# EAGLE design front-panel-board (EAGLE 5.11)
DRAWN_BY: Alexios; PROJECT_NAME: CFT Mini-Computer; REVISION: Rev D; SHEET_DESCRIPTION: Front Panel: Switch board; SIMULATION_FILENAME: N/A; URL: http://www.bedroomlan.org/cft

## Sheet 1 of 2
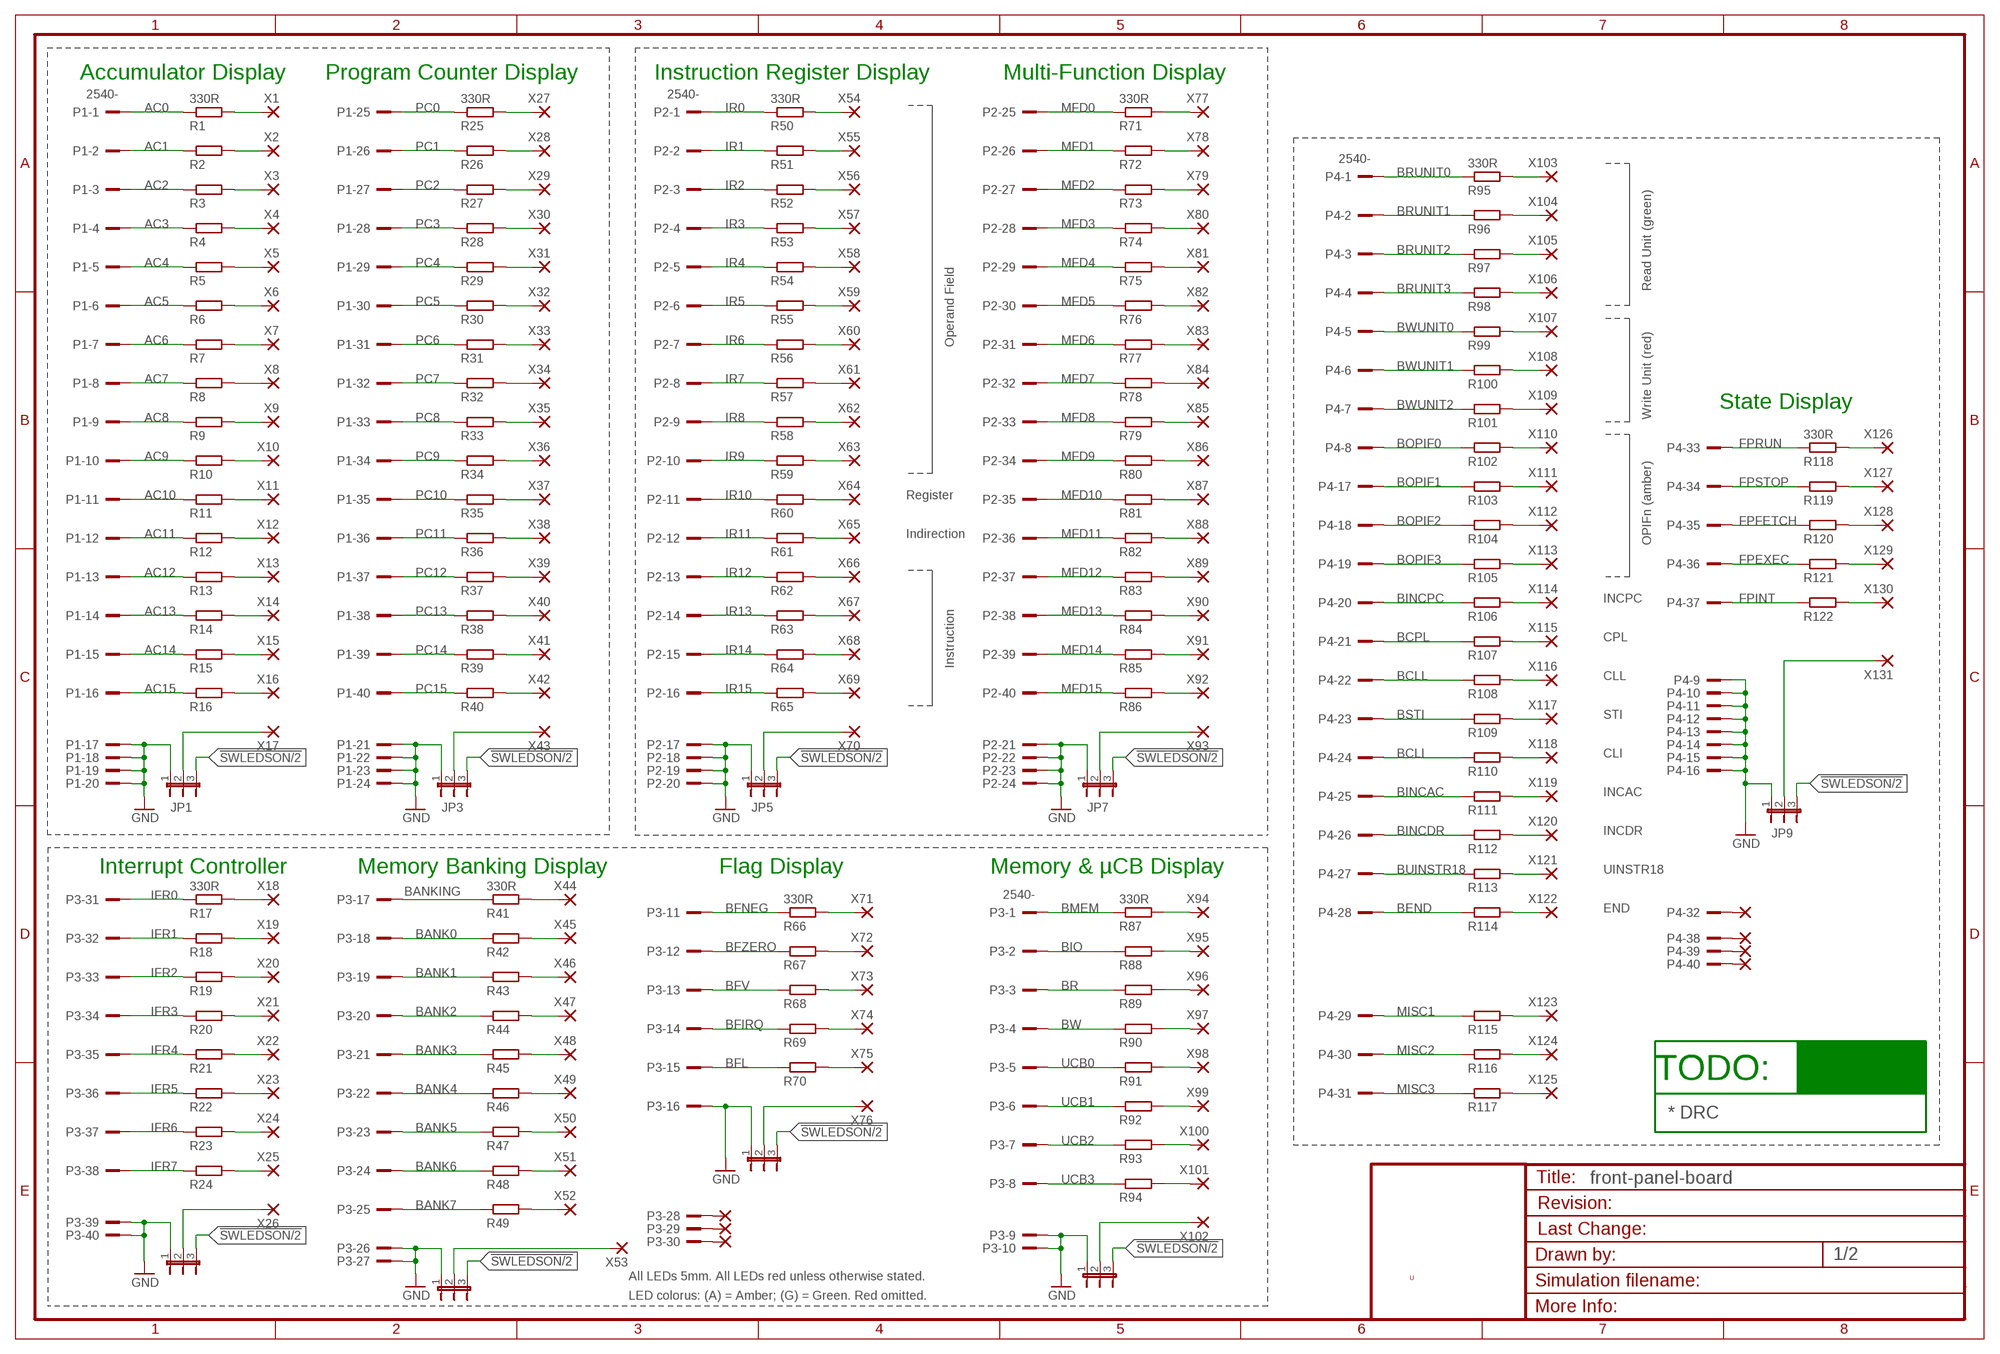
[diagram p0: schematic, sheet 1]

### Parts
JP1  JP2E  [JP2]
JP2  JP2E  [JP2]
JP3  JP2E  [JP2]
JP4  JP2E  [JP2]
JP5  JP2E  [JP2]
JP6  JP2E  [JP2]
JP7  JP2E  [JP2]
JP8  JP2E  [JP2]
JP9  JP2E  [JP2]
P1  2540-  [PAK100/2500-40]
P2  2540-  [PAK100/2500-40]
P3  2540-  [PAK100/2500-40]
P4  2540-  [PAK100/2500-40]
PAD1  1,6/0,8  [1,6/0,8]
PAD2  1,6/0,8  [1,6/0,8]
PAD3  1,6/0,8  [1,6/0,8]
PAD4  1,6/0,8  [1,6/0,8]
PAD5  1,6/0,8  [1,6/0,8]
PAD6  1,6/0,8  [1,6/0,8]
PAD7  1,6/0,8  [1,6/0,8]
R1  330R  R-EU_0204/7  [0204/7]
R2  330R  R-EU_0204/7  [0204/7]
R3  330R  R-EU_0204/7  [0204/7]
R4  330R  R-EU_0204/7  [0204/7]
R5  330R  R-EU_0204/7  [0204/7]
R6  330R  R-EU_0204/7  [0204/7]
R7  330R  R-EU_0204/7  [0204/7]
R8  330R  R-EU_0204/7  [0204/7]
R9  330R  R-EU_0204/7  [0204/7]
R10  330R  R-EU_0204/7  [0204/7]
R11  330R  R-EU_0204/7  [0204/7]
R12  330R  R-EU_0204/7  [0204/7]
R13  330R  R-EU_0204/7  [0204/7]
R14  330R  R-EU_0204/7  [0204/7]
R15  330R  R-EU_0204/7  [0204/7]
R16  330R  R-EU_0204/7  [0204/7]
R17  330R  R-EU_0204/7  [0204/7]
R18  330R  R-EU_0204/7  [0204/7]
R19  330R  R-EU_0204/7  [0204/7]
R20  330R  R-EU_0204/7  [0204/7]
R21  330R  R-EU_0204/7  [0204/7]
R22  330R  R-EU_0204/7  [0204/7]
R23  330R  R-EU_0204/7  [0204/7]
R24  330R  R-EU_0204/7  [0204/7]
R25  330R  R-EU_0204/7  [0204/7]
R26  330R  R-EU_0204/7  [0204/7]
R27  330R  R-EU_0204/7  [0204/7]
R28  330R  R-EU_0204/7  [0204/7]
R29  330R  R-EU_0204/7  [0204/7]
R30  330R  R-EU_0204/7  [0204/7]
R31  330R  R-EU_0204/7  [0204/7]
R32  330R  R-EU_0204/7  [0204/7]
R33  330R  R-EU_0204/7  [0204/7]
R34  330R  R-EU_0204/7  [0204/7]
R35  330R  R-EU_0204/7  [0204/7]
R36  330R  R-EU_0204/7  [0204/7]
R37  330R  R-EU_0204/7  [0204/7]
R38  330R  R-EU_0204/7  [0204/7]
R39  330R  R-EU_0204/7  [0204/7]
R40  330R  R-EU_0204/7  [0204/7]
R41  330R  R-EU_0204/7  [0204/7]
R42  330R  R-EU_0204/7  [0204/7]
R43  330R  R-EU_0204/7  [0204/7]
R44  330R  R-EU_0204/7  [0204/7]
R45  330R  R-EU_0204/7  [0204/7]
R46  330R  R-EU_0204/7  [0204/7]
R47  330R  R-EU_0204/7  [0204/7]
R48  330R  R-EU_0204/7  [0204/7]
R49  330R  R-EU_0204/7  [0204/7]
R50  330R  R-EU_0204/7  [0204/7]
R51  330R  R-EU_0204/7  [0204/7]
R52  330R  R-EU_0204/7  [0204/7]
R53  330R  R-EU_0204/7  [0204/7]
R54  330R  R-EU_0204/7  [0204/7]
R55  330R  R-EU_0204/7  [0204/7]
R56  330R  R-EU_0204/7  [0204/7]
R57  330R  R-EU_0204/7  [0204/7]
R58  330R  R-EU_0204/7  [0204/7]
R59  330R  R-EU_0204/7  [0204/7]
R60  330R  R-EU_0204/7  [0204/7]
R61  330R  R-EU_0204/7  [0204/7]
R62  330R  R-EU_0204/7  [0204/7]
R63  330R  R-EU_0204/7  [0204/7]
R64  330R  R-EU_0204/7  [0204/7]
R65  330R  R-EU_0204/7  [0204/7]
R66  330R  R-EU_0204/7  [0204/7]
R67  330R  R-EU_0204/7  [0204/7]
R68  330R  R-EU_0204/7  [0204/7]
R69  330R  R-EU_0204/7  [0204/7]
R70  330R  R-EU_0204/7  [0204/7]
R71  330R  R-EU_0204/7  [0204/7]
R72  330R  R-EU_0204/7  [0204/7]
R73  330R  R-EU_0204/7  [0204/7]
R74  330R  R-EU_0204/7  [0204/7]
R75  330R  R-EU_0204/7  [0204/7]
R76  330R  R-EU_0204/7  [0204/7]
R77  330R  R-EU_0204/7  [0204/7]
R78  330R  R-EU_0204/7  [0204/7]
R79  330R  R-EU_0204/7  [0204/7]
R80  330R  R-EU_0204/7  [0204/7]
R81  330R  R-EU_0204/7  [0204/7]
R82  330R  R-EU_0204/7  [0204/7]
R83  330R  R-EU_0204/7  [0204/7]
R84  330R  R-EU_0204/7  [0204/7]
R85  330R  R-EU_0204/7  [0204/7]
R86  330R  R-EU_0204/7  [0204/7]
R87  330R  R-EU_0204/7  [0204/7]
R88  330R  R-EU_0204/7  [0204/7]
R89  330R  R-EU_0204/7  [0204/7]
R90  330R  R-EU_0204/7  [0204/7]
R91  330R  R-EU_0204/7  [0204/7]
R92  330R  R-EU_0204/7  [0204/7]
R93  330R  R-EU_0204/7  [0204/7]
R94  330R  R-EU_0204/7  [0204/7]
R95  330R  R-EU_0204/7  [0204/7]
R96  330R  R-EU_0204/7  [0204/7]
R97  330R  R-EU_0204/7  [0204/7]
R98  330R  R-EU_0204/7  [0204/7]
R99  330R  R-EU_0204/7  [0204/7]
R100  330R  R-EU_0204/7  [0204/7]
R101  330R  R-EU_0204/7  [0204/7]
R102  330R  R-EU_0204/7  [0204/7]
R103  330R  R-EU_0204/7  [0204/7]
R104  330R  R-EU_0204/7  [0204/7]
R105  330R  R-EU_0204/7  [0204/7]
R106  330R  R-EU_0204/7  [0204/7]
R107  330R  R-EU_0204/7  [0204/7]
R108  330R  R-EU_0204/7  [0204/7]
R109  330R  R-EU_0204/7  [0204/7]
R110  330R  R-EU_0204/7  [0204/7]
R111  330R  R-EU_0204/7  [0204/7]
R112  330R  R-EU_0204/7  [0204/7]
R113  330R  R-EU_0204/7  [0204/7]
R114  330R  R-EU_0204/7  [0204/7]
R115  330R  R-EU_0204/7  [0204/7]
R116  330R  R-EU_0204/7  [0204/7]
R117  330R  R-EU_0204/7  [0204/7]
R118  330R  R-EU_0204/7  [0204/7]
R119  330R  R-EU_0204/7  [0204/7]
R120  330R  R-EU_0204/7  [0204/7]
R121  330R  R-EU_0204/7  [0204/7]
R122  330R  R-EU_0204/7  [0204/7]
X1  1,6/0,9  [1,6/0,9]
X2  1,6/0,9  [1,6/0,9]
X3  1,6/0,9  [1,6/0,9]
X4  1,6/0,9  [1,6/0,9]
X5  1,6/0,9  [1,6/0,9]
X6  1,6/0,9  [1,6/0,9]
X7  1,6/0,9  [1,6/0,9]
X8  1,6/0,9  [1,6/0,9]
X9  1,6/0,9  [1,6/0,9]
X10  1,6/0,9  [1,6/0,9]
X11  1,6/0,9  [1,6/0,9]
X12  1,6/0,9  [1,6/0,9]
X13  1,6/0,9  [1,6/0,9]
X14  1,6/0,9  [1,6/0,9]
X15  1,6/0,9  [1,6/0,9]
X16  1,6/0,9  [1,6/0,9]
X17  2,54/1,0  [2,54/1,0]
X18  1,6/0,9  [1,6/0,9]
X19  1,6/0,9  [1,6/0,9]
X20  1,6/0,9  [1,6/0,9]
X21  1,6/0,9  [1,6/0,9]
X22  1,6/0,9  [1,6/0,9]
X23  1,6/0,9  [1,6/0,9]
X24  1,6/0,9  [1,6/0,9]
X25  1,6/0,9  [1,6/0,9]
X26  2,54/1,0  [2,54/1,0]
X27  1,6/0,9  [1,6/0,9]
X28  1,6/0,9  [1,6/0,9]
X29  1,6/0,9  [1,6/0,9]
X30  1,6/0,9  [1,6/0,9]
X31  1,6/0,9  [1,6/0,9]
X32  1,6/0,9  [1,6/0,9]
X33  1,6/0,9  [1,6/0,9]
X34  1,6/0,9  [1,6/0,9]
X35  1,6/0,9  [1,6/0,9]
X36  1,6/0,9  [1,6/0,9]
X37  1,6/0,9  [1,6/0,9]
X38  1,6/0,9  [1,6/0,9]
X39  1,6/0,9  [1,6/0,9]
X40  1,6/0,9  [1,6/0,9]
X41  1,6/0,9  [1,6/0,9]
X42  1,6/0,9  [1,6/0,9]
X43  2,54/1,0  [2,54/1,0]
X44  1,6/0,9  [1,6/0,9]
X45  1,6/0,9  [1,6/0,9]
X46  1,6/0,9  [1,6/0,9]
X47  1,6/0,9  [1,6/0,9]
X48  1,6/0,9  [1,6/0,9]
X49  1,6/0,9  [1,6/0,9]
X50  1,6/0,9  [1,6/0,9]
X51  1,6/0,9  [1,6/0,9]
X52  1,6/0,9  [1,6/0,9]
X53  2,54/1,0  [2,54/1,0]
X54  1,6/0,9  [1,6/0,9]
X55  1,6/0,9  [1,6/0,9]
X56  1,6/0,9  [1,6/0,9]
X57  1,6/0,9  [1,6/0,9]
X58  1,6/0,9  [1,6/0,9]
X59  1,6/0,9  [1,6/0,9]
X60  1,6/0,9  [1,6/0,9]
X61  1,6/0,9  [1,6/0,9]
X62  1,6/0,9  [1,6/0,9]
X63  1,6/0,9  [1,6/0,9]
X64  1,6/0,9  [1,6/0,9]
X65  1,6/0,9  [1,6/0,9]
X66  1,6/0,9  [1,6/0,9]
X67  1,6/0,9  [1,6/0,9]
X68  1,6/0,9  [1,6/0,9]
X69  1,6/0,9  [1,6/0,9]
X70  2,54/1,0  [2,54/1,0]
X71  1,6/0,9  [1,6/0,9]
X72  1,6/0,9  [1,6/0,9]
X73  1,6/0,9  [1,6/0,9]
X74  1,6/0,9  [1,6/0,9]
X75  1,6/0,9  [1,6/0,9]
X76  2,54/1,0  [2,54/1,0]
X77  1,6/0,9  [1,6/0,9]
X78  1,6/0,9  [1,6/0,9]
X79  1,6/0,9  [1,6/0,9]
X80  1,6/0,9  [1,6/0,9]
X81  1,6/0,9  [1,6/0,9]
X82  1,6/0,9  [1,6/0,9]
X83  1,6/0,9  [1,6/0,9]
X84  1,6/0,9  [1,6/0,9]
X85  1,6/0,9  [1,6/0,9]
X86  1,6/0,9  [1,6/0,9]
X87  1,6/0,9  [1,6/0,9]
X88  1,6/0,9  [1,6/0,9]
X89  1,6/0,9  [1,6/0,9]
X90  1,6/0,9  [1,6/0,9]
X91  1,6/0,9  [1,6/0,9]
X92  1,6/0,9  [1,6/0,9]
X93  2,54/1,0  [2,54/1,0]
X94  1,6/0,9  [1,6/0,9]
X95  1,6/0,9  [1,6/0,9]
X96  1,6/0,9  [1,6/0,9]
X97  1,6/0,9  [1,6/0,9]
X98  1,6/0,9  [1,6/0,9]
X99  1,6/0,9  [1,6/0,9]
X100  1,6/0,9  [1,6/0,9]
X101  1,6/0,9  [1,6/0,9]
X102  2,54/1,0  [2,54/1,0]
X103  1,6/0,9  [1,6/0,9]
X104  1,6/0,9  [1,6/0,9]
X105  1,6/0,9  [1,6/0,9]
X106  1,6/0,9  [1,6/0,9]
X107  1,6/0,9  [1,6/0,9]
X108  1,6/0,9  [1,6/0,9]
X109  1,6/0,9  [1,6/0,9]
X110  1,6/0,9  [1,6/0,9]
X111  1,6/0,9  [1,6/0,9]
X112  1,6/0,9  [1,6/0,9]
X113  1,6/0,9  [1,6/0,9]
X114  1,6/0,9  [1,6/0,9]
X115  1,6/0,9  [1,6/0,9]
X116  1,6/0,9  [1,6/0,9]
X117  1,6/0,9  [1,6/0,9]
X118  1,6/0,9  [1,6/0,9]
X119  1,6/0,9  [1,6/0,9]
X120  1,6/0,9  [1,6/0,9]
X121  1,6/0,9  [1,6/0,9]
X122  1,6/0,9  [1,6/0,9]
X123  1,6/0,9  [1,6/0,9]
X124  1,6/0,9  [1,6/0,9]
X125  1,6/0,9  [1,6/0,9]
X126  1,6/0,9  [1,6/0,9]
X127  1,6/0,9  [1,6/0,9]
X128  1,6/0,9  [1,6/0,9]
X129  1,6/0,9  [1,6/0,9]
X130  1,6/0,9  [1,6/0,9]
X131  2,54/1,0  [2,54/1,0]

### Nets
!SWLEDSON [12V]: JP1.3 JP2.3 JP3.3 JP4.3 JP5.3 JP6.3 JP7.3 JP8.3 JP9.3 ; also sheet 2
AC0: P1.1 R1.1
AC1: P1.2 R2.1
AC2: P1.3 R3.1
AC3: P1.4 R4.1
AC4: P1.5 R5.1
AC5: P1.6 R6.1
AC6: P1.7 R7.1
AC7: P1.8 R8.1
AC8: P1.9 R9.1
AC9: P1.10 R10.1
AC10: P1.11 R11.1
AC11: P1.12 R12.1
AC12: P1.13 R13.1
AC13: P1.14 R14.1
AC14: P1.15 R15.1
AC15: P1.16 R16.1
BANK0: P3.18 R42.1
BANK1: P3.19 R43.1
BANK2: P3.20 R44.1
BANK3: P3.21 R45.1
BANK4: P3.22 R46.1
BANK5: P3.23 R47.1
BANK6: P3.24 R48.1
BANK7: P3.25 R49.1
BANKING: P3.17 R41.1
BCLI: P4.24 R110.1
BCLL: P4.22 R108.1
BCPL: P4.21 R107.1
BEND: P4.28 R114.1
BFIRQ: P3.14 R69.1
BFL: P3.15 R70.1
BFNEG: P3.11 R66.1
BFV: P3.13 R68.1
BFZERO: P3.12 R67.1
BINCAC: P4.25 R111.1
BINCDR: P4.26 R112.1
BINCPC: P4.20 R106.1
BIO: P3.2 R88.1
BMEM: P3.1 R87.1
BOPIF0: P4.8 R102.1
BOPIF1: P4.17 R103.1
BOPIF2: P4.18 R104.1
BOPIF3: P4.19 R105.1
BR: P3.3 R89.1
BRUNIT0: P4.1 R95.1
BRUNIT1: P4.2 R96.1
BRUNIT2: P4.3 R97.1
BRUNIT3: P4.4 R98.1
BSTI: P4.23 R109.1
BUINSTR18: P4.27 R113.1
BW: P3.4 R90.1
BWUNIT0: P4.5 R99.1
BWUNIT1: P4.6 R100.1
BWUNIT2: P4.7 R101.1
FPEXEC: P4.36 R121.1
FPFETCH: P4.35 R120.1
FPINT: P4.37 R122.1
FPRUN: P4.33 R118.1
FPSTOP: P4.34 R119.1
GND [Power]: JP1.1 JP2.1 JP3.1 JP4.1 JP5.1 JP6.1 JP7.1 JP8.1 JP9.1 P1.17 P1.18 P1.19 P1.20 P1.21 P1.22 P1.23 P1.24 P2.17 P2.18 P2.19 P2.20 P2.21 P2.22 P2.23 P2.24 P3.9 P3.10 P3.16 P3.26 P3.27 P3.39 P3.40 P4.9 P4.10 P4.11 P4.12 P4.13 P4.14 P4.15 P4.16 ; also sheet 2
IFR0: P3.31 R17.1
IFR1: P3.32 R18.1
IFR2: P3.33 R19.1
IFR3: P3.34 R20.1
IFR4: P3.35 R21.1
IFR5: P3.36 R22.1
IFR6: P3.37 R23.1
IFR7: P3.38 R24.1
IR0: P2.1 R50.1
IR1: P2.2 R51.1
IR2: P2.3 R52.1
IR3: P2.4 R53.1
IR4: P2.5 R54.1
IR5: P2.6 R55.1
IR6: P2.7 R56.1
IR7: P2.8 R57.1
IR8: P2.9 R58.1
IR9: P2.10 R59.1
IR10: P2.11 R60.1
IR11: P2.12 R61.1
IR12: P2.13 R62.1
IR13: P2.14 R63.1
IR14: P2.15 R64.1
IR15: P2.16 R65.1
MFD0: P2.25 R71.1
MFD1: P2.26 R72.1
MFD2: P2.27 R73.1
MFD3: P2.28 R74.1
MFD4: P2.29 R75.1
MFD5: P2.30 R76.1
MFD6: P2.31 R77.1
MFD7: P2.32 R78.1
MFD8: P2.33 R79.1
MFD9: P2.34 R80.1
MFD10: P2.35 R81.1
MFD11: P2.36 R82.1
MFD12: P2.37 R83.1
MFD13: P2.38 R84.1
MFD14: P2.39 R85.1
MFD15: P2.40 R86.1
MISC1: P4.29 R115.1
MISC2: P4.30 R116.1
MISC3: P4.31 R117.1
N$1 [Power]: JP5.2 X70.1(P)
N$2 [Power]: JP7.2 X93.1(P)
N$3 [Power]: JP2.2 X26.1(P)
N$4 [Power]: JP6.2 X76.1(P)
N$5 [Power]: JP8.2 X102.1(P)
N$6: R24.2 X25.1(P)
N$7: R23.2 X24.1(P)
N$323 [Power]: JP3.2 X43.1(P)
N$324 [Power]: JP1.2 X17.1(P)
N$325: R96.2 X104.1(P)
N$326: R4.2 X4.1(P)
N$327: R67.2 X72.1(P)
N$328: R95.2 X103.1(P)
N$330: R17.2 X18.1(P)
N$412: R3.2 X3.1(P)
N$413: R2.2 X2.1(P)
N$414: R1.2 X1.1(P)
N$415: R7.2 X7.1(P)
N$416: R6.2 X6.1(P)
N$449: R5.2 X5.1(P)
N$450: P3.28 PAD1.1(P)
N$451: R89.2 X96.1(P)
N$470: P4.38 PAD5.1(P)
N$471: P4.39 PAD6.1(P)
N$472: P4.40 PAD7.1(P)
N$473: P4.32 PAD4.1(P)
N$474: P3.29 PAD2.1(P)
N$475: P3.30 PAD3.1(P)
N$477: R10.2 X10.1(P)
N$478: R9.2 X9.1(P)
N$587: R8.2 X8.1(P)
N$588: R13.2 X13.1(P)
N$589: R12.2 X12.1(P)
N$590: R11.2 X11.1(P)
N$591: R16.2 X16.1(P)
N$592: R15.2 X15.1(P)
N$593: R14.2 X14.1(P)
N$594: R28.2 X30.1(P)
N$595: R27.2 X29.1(P)
N$596: R26.2 X28.1(P)
N$597: R25.2 X27.1(P)
N$598: R31.2 X33.1(P)
N$599: R30.2 X32.1(P)
N$600: R29.2 X31.1(P)
N$601: R34.2 X36.1(P)
N$602: R33.2 X35.1(P)
N$603: R32.2 X34.1(P)
N$604: R37.2 X39.1(P)
N$605: R36.2 X38.1(P)
N$606: R35.2 X37.1(P)
N$607: R40.2 X42.1(P)
N$608: R39.2 X41.1(P)
N$609: R38.2 X40.1(P)
N$611: R53.2 X57.1(P)
N$612: R52.2 X56.1(P)
N$613: R51.2 X55.1(P)
N$614: R50.2 X54.1(P)
N$615: R56.2 X60.1(P)
N$616: R55.2 X59.1(P)
N$617: R54.2 X58.1(P)
N$618: R59.2 X63.1(P)
N$619: R58.2 X62.1(P)
N$620: R57.2 X61.1(P)
N$621: R62.2 X66.1(P)
N$622: R61.2 X65.1(P)
N$623: R60.2 X64.1(P)
N$624: R65.2 X69.1(P)
N$625: R64.2 X68.1(P)
N$626: R63.2 X67.1(P)
N$627: R74.2 X80.1(P)
N$628: R73.2 X79.1(P)
N$629: R72.2 X78.1(P)
N$630: R77.2 X83.1(P)
N$631: R76.2 X82.1(P)
N$632: R75.2 X81.1(P)
N$633: R80.2 X86.1(P)
N$634: R79.2 X85.1(P)
N$635: R78.2 X84.1(P)
N$636: R83.2 X89.1(P)
N$637: R82.2 X88.1(P)
N$638: R81.2 X87.1(P)
N$639: R86.2 X92.1(P)
N$640: R85.2 X91.1(P)
N$641: R84.2 X90.1(P)
N$642: R71.2 X77.1(P)
N$643: R18.2 X19.1(P)
N$644: R19.2 X20.1(P)
N$645: R20.2 X21.1(P)
N$646: R21.2 X22.1(P)
N$647: R22.2 X23.1(P)
N$658 [Power]: JP9.2 X131.1(P)
N$659: R41.2 X44.1(P)
N$660: R42.2 X45.1(P)
N$661: R43.2 X46.1(P)
N$662: R44.2 X47.1(P)
N$663: R45.2 X48.1(P)
N$664: R46.2 X49.1(P)
N$665: R47.2 X50.1(P)
N$666: R48.2 X51.1(P)
N$667: R49.2 X52.1(P)
N$668 [Power]: JP4.2 X53.1(P)
N$669: R66.2 X71.1(P)
N$670: R68.2 X73.1(P)
N$671: R69.2 X74.1(P)
N$672: R70.2 X75.1(P)
N$676: R87.2 X94.1(P)
N$677: R88.2 X95.1(P)
N$796: R90.2 X97.1(P)
N$797: R91.2 X98.1(P)
N$798: R92.2 X99.1(P)
N$799: R93.2 X100.1(P)
N$800: R94.2 X101.1(P)
N$802: R97.2 X105.1(P)
N$803: R98.2 X106.1(P)
N$804: R99.2 X107.1(P)
N$805: R100.2 X108.1(P)
N$806: R101.2 X109.1(P)
N$807: R102.2 X110.1(P)
N$808: R104.2 X112.1(P)
N$809: R103.2 X111.1(P)
N$810: R105.2 X113.1(P)
N$811: R106.2 X114.1(P)
N$812: R107.2 X115.1(P)
N$813: R108.2 X116.1(P)
N$814: R109.2 X117.1(P)
N$815: R110.2 X118.1(P)
N$816: R112.2 X120.1(P)
N$817: R111.2 X119.1(P)
N$818: R113.2 X121.1(P)
N$819: R114.2 X122.1(P)
N$820: R115.2 X123.1(P)
N$821: R116.2 X124.1(P)
N$822: R117.2 X125.1(P)
N$823: R118.2 X126.1(P)
N$824: R120.2 X128.1(P)
N$825: R122.2 X130.1(P)
N$826: R119.2 X127.1(P)
N$827: R121.2 X129.1(P)
PC0: P1.25 R25.1
PC1: P1.26 R26.1
PC2: P1.27 R27.1
PC3: P1.28 R28.1
PC4: P1.29 R29.1
PC5: P1.30 R30.1
PC6: P1.31 R31.1
PC7: P1.32 R32.1
PC8: P1.33 R33.1
PC9: P1.34 R34.1
PC10: P1.35 R35.1
PC11: P1.36 R36.1
PC12: P1.37 R37.1
PC13: P1.38 R38.1
PC14: P1.39 R39.1
PC15: P1.40 R40.1
UCB0: P3.5 R91.1
UCB1: P3.6 R92.1
UCB2: P3.7 R93.1
UCB3: P3.8 R94.1

### Notes on the sheet
- Accumulator Display | Program Counter Display | Instruction Register Display | Multi-Function Display
- Read Unit (green)
- Operand Field
- Write Unit (red)
- State Display
- OPIFn (amber)
- Register
- Indirection
- INCPC
- Instruction
- CPL
- CLL
- STI
- CLI
- INCAC
- INCDR
- Interrupt Controller | Memory Banking Display | Flag Display | Memory & µCB Display | UINSTR18
- END
- TODO:
- * DRC
- All LEDs 5mm. All LEDs red unless otherwise stated. | U
- LED colorus: (A) = Amber; (G) = Green. Red omitted.

## Sheet 2 of 2
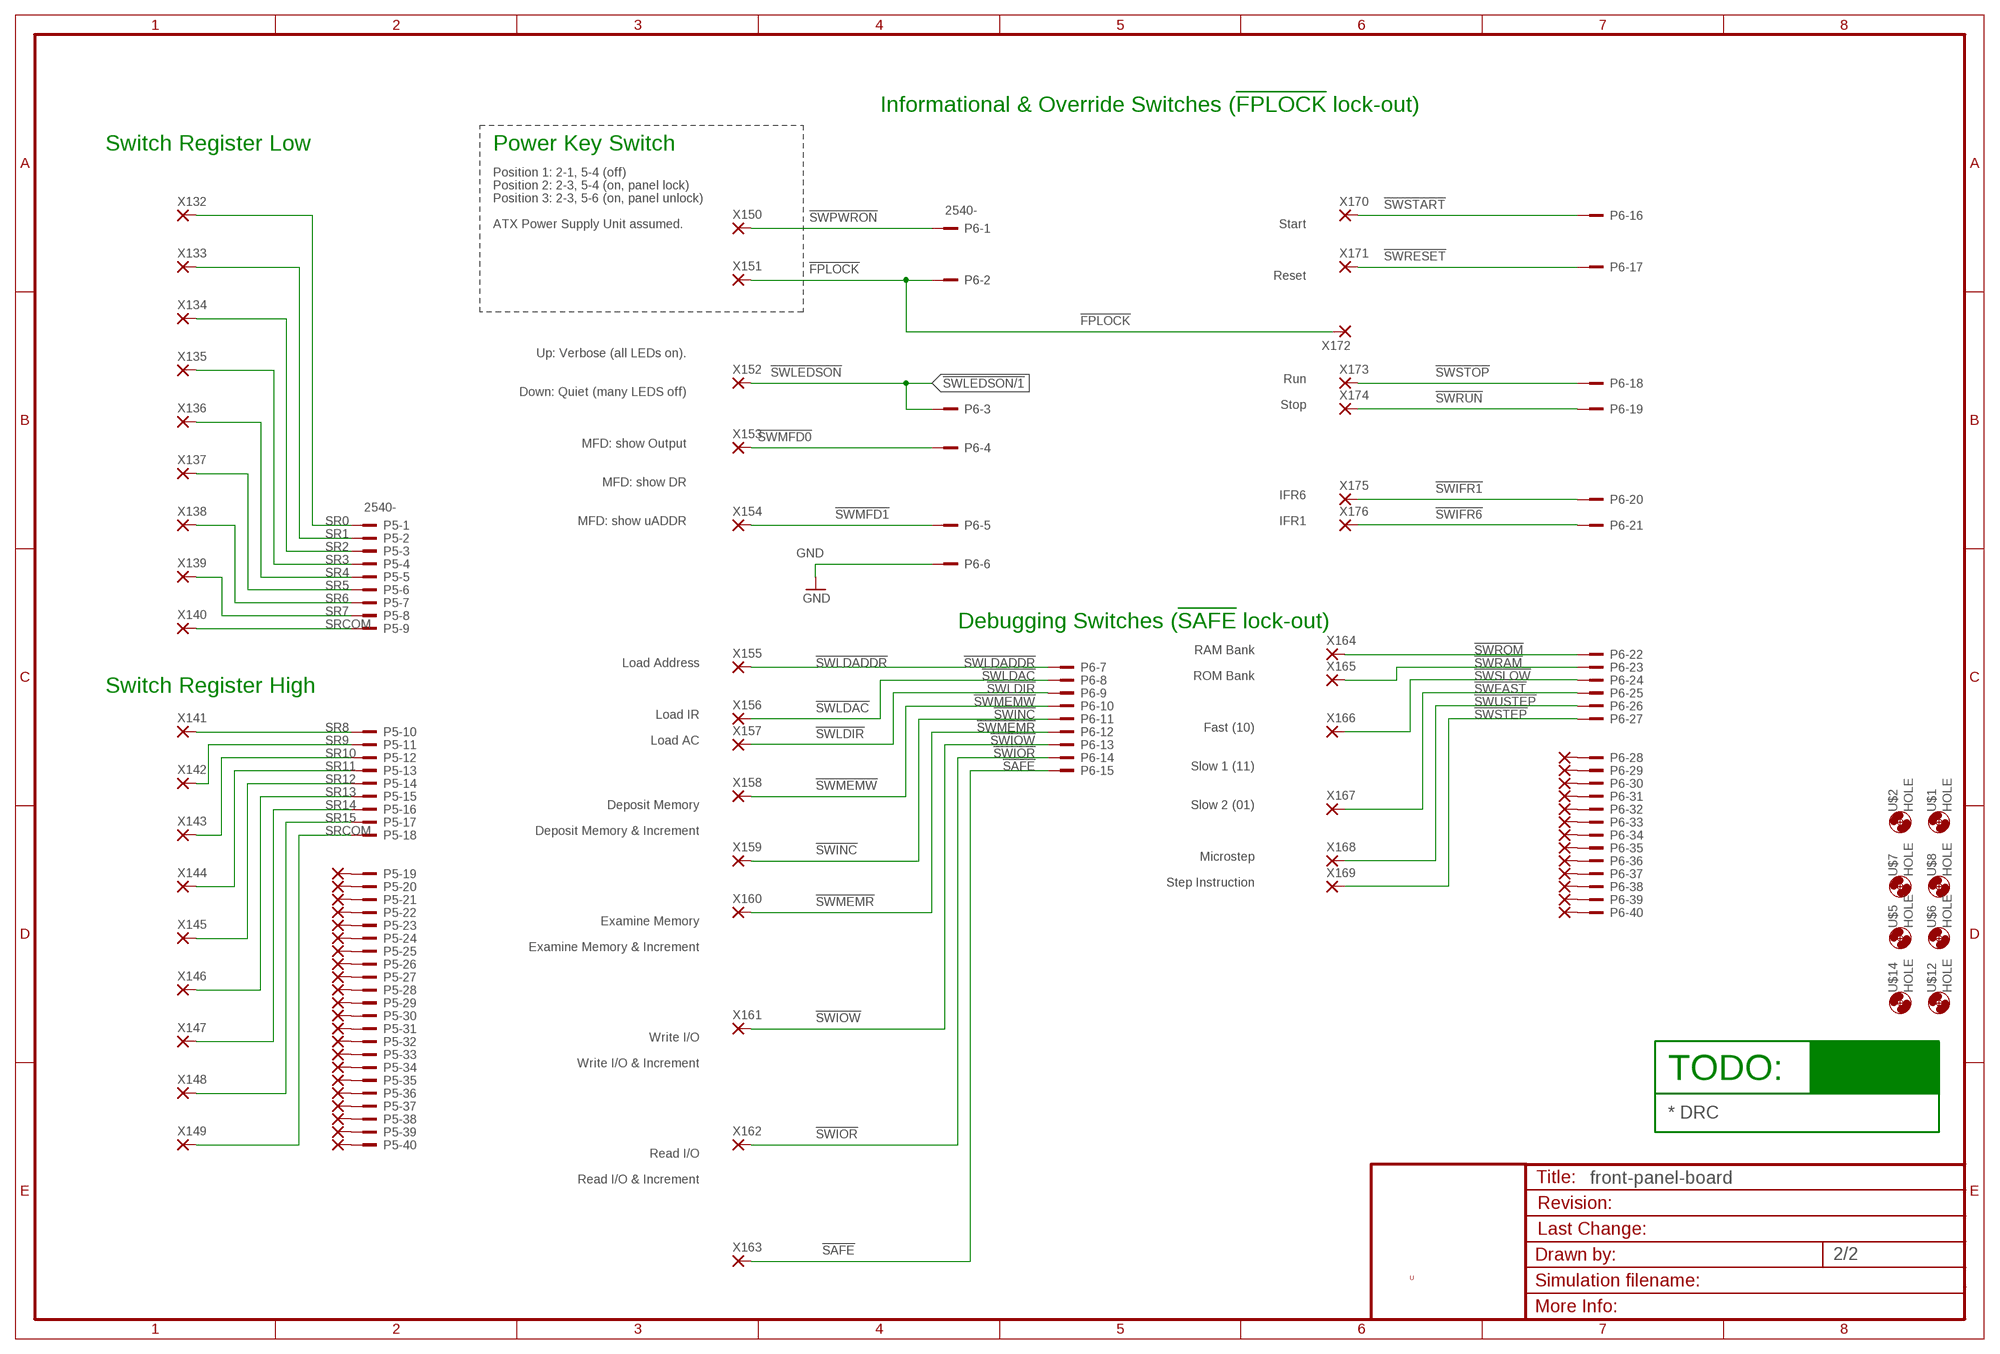
[diagram p1: schematic, sheet 2]

### Parts
P5  2540-  [PAK100/2500-40]
P6  2540-  [PAK100/2500-40]
PAD8  1,6/0,8  [1,6/0,8]
PAD9  1,6/0,8  [1,6/0,8]
PAD10  1,6/0,8  [1,6/0,8]
PAD11  1,6/0,8  [1,6/0,8]
PAD12  1,6/0,8  [1,6/0,8]
PAD13  1,6/0,8  [1,6/0,8]
PAD14  1,6/0,8  [1,6/0,8]
PAD15  1,6/0,8  [1,6/0,8]
PAD16  1,6/0,8  [1,6/0,8]
PAD17  1,6/0,8  [1,6/0,8]
PAD18  1,6/0,8  [1,6/0,8]
PAD19  1,6/0,8  [1,6/0,8]
PAD20  1,6/0,8  [1,6/0,8]
PAD21  1,6/0,8  [1,6/0,8]
PAD22  1,6/0,8  [1,6/0,8]
PAD23  1,6/0,8  [1,6/0,8]
PAD24  1,6/0,8  [1,6/0,8]
PAD25  1,6/0,8  [1,6/0,8]
PAD26  1,6/0,8  [1,6/0,8]
PAD27  1,6/0,8  [1,6/0,8]
PAD28  1,6/0,8  [1,6/0,8]
PAD29  1,6/0,8  [1,6/0,8]
U$1  HOLE  [STANDOFF_28_60]
U$2  HOLE  [STANDOFF_28_60]
U$5  HOLE  [STANDOFF_28_60]
U$6  HOLE  [STANDOFF_28_60]
U$7  HOLE  [STANDOFF_28_60]
U$8  HOLE  [STANDOFF_28_60]
U$12  HOLE  [STANDOFF_28_60]
U$14  HOLE  [STANDOFF_28_60]
X132  1,6/0,9  [1,6/0,9]
X133  1,6/0,9  [1,6/0,9]
X134  1,6/0,9  [1,6/0,9]
X135  1,6/0,9  [1,6/0,9]
X136  1,6/0,9  [1,6/0,9]
X137  1,6/0,9  [1,6/0,9]
X138  1,6/0,9  [1,6/0,9]
X139  1,6/0,9  [1,6/0,9]
X140  2,54/1,0  [2,54/1,0]
X141  1,6/0,9  [1,6/0,9]
X142  1,6/0,9  [1,6/0,9]
X143  1,6/0,9  [1,6/0,9]
X144  1,6/0,9  [1,6/0,9]
X145  1,6/0,9  [1,6/0,9]
X146  1,6/0,9  [1,6/0,9]
X147  1,6/0,9  [1,6/0,9]
X148  1,6/0,9  [1,6/0,9]
X149  2,54/1,0  [2,54/1,0]
X150  1,6/0,9  [1,6/0,9]
X151  1,6/0,9  [1,6/0,9]
X152  1,6/0,9  [1,6/0,9]
X153  1,6/0,9  [1,6/0,9]
X154  1,6/0,9  [1,6/0,9]
X155  1,6/0,9  [1,6/0,9]
X156  1,6/0,9  [1,6/0,9]
X157  1,6/0,9  [1,6/0,9]
X158  1,6/0,9  [1,6/0,9]
X159  1,6/0,9  [1,6/0,9]
X160  1,6/0,9  [1,6/0,9]
X161  1,6/0,9  [1,6/0,9]
X162  1,6/0,9  [1,6/0,9]
X163  2,54/1,0  [2,54/1,0]
X164  1,6/0,9  [1,6/0,9]
X165  1,6/0,9  [1,6/0,9]
X166  1,6/0,9  [1,6/0,9]
X167  1,6/0,9  [1,6/0,9]
X168  1,6/0,9  [1,6/0,9]
X169  1,6/0,9  [1,6/0,9]
X170  1,6/0,9  [1,6/0,9]
X171  1,6/0,9  [1,6/0,9]
X172  2,54/1,0  [2,54/1,0]
X173  1,6/0,9  [1,6/0,9]
X174  1,6/0,9  [1,6/0,9]
X175  1,6/0,9  [1,6/0,9]
X176  1,6/0,9  [1,6/0,9]
X177  1,6/0,9  [1,6/0,9]
X178  1,6/0,9  [1,6/0,9]
X179  1,6/0,9  [1,6/0,9]
X180  1,6/0,9  [1,6/0,9]
X181  1,6/0,9  [1,6/0,9]
X182  1,6/0,9  [1,6/0,9]
X183  1,6/0,9  [1,6/0,9]
X184  1,6/0,9  [1,6/0,9]
X185  1,6/0,9  [1,6/0,9]
X186  1,6/0,9  [1,6/0,9]
X187  1,6/0,9  [1,6/0,9]
X188  1,6/0,9  [1,6/0,9]
X189  1,6/0,9  [1,6/0,9]

### Nets
!FPLOCK: P6.2 X151.1(P) X172.1(P)
!SAFE: P6.15 X163.1(P)
!SWFAST: P6.25 X167.1(P)
!SWIFR1: P6.20 X175.1(P)
!SWIFR6: P6.21 X176.1(P)
!SWINC: P6.11 X159.1(P)
!SWIOR: P6.14 X162.1(P)
!SWIOW: P6.13 X161.1(P)
!SWLDAC: P6.8 X156.1(P)
!SWLDADDR: P6.7 X155.1(P)
!SWLDIR: P6.9 X157.1(P)
!SWLEDSON [12V]: P6.3 X152.1(P) ; also sheet 1
!SWMEMR: P6.12 X160.1(P)
!SWMEMW: P6.10 X158.1(P)
!SWMFD0: P6.4 X153.1(P)
!SWMFD1: P6.5 X154.1(P)
!SWPWRON: P6.1 X150.1(P)
!SWRAM: P6.23 X165.1(P)
!SWRESET: P6.17 X171.1(P)
!SWROM: P6.22 X164.1(P)
!SWRUN: P6.19 X174.1(P)
!SWSLOW: P6.24 X166.1(P)
!SWSTART: P6.16 X170.1(P)
!SWSTEP: P6.27 X169.1(P)
!SWSTOP: P6.18 X173.1(P)
!SWUSTEP: P6.26 X168.1(P)
GND [Power]: P6.6 ; also sheet 1
N$8: P6.28 X177.1(P)
N$9: P6.29 X178.1(P)
N$10: P6.30 X179.1(P)
N$11: P6.31 X180.1(P)
N$12: P6.32 X181.1(P)
N$13: P6.33 X182.1(P)
N$14: P6.34 X183.1(P)
N$15: P6.35 X184.1(P)
N$16: P6.36 X185.1(P)
N$17: P6.37 X186.1(P)
N$18: P6.38 X187.1(P)
N$19: P6.39 X188.1(P)
N$20: P6.40 X189.1(P)
N$552: P5.19 PAD8.1(P)
N$553: P5.20 PAD9.1(P)
N$554: P5.21 PAD10.1(P)
N$555: P5.22 PAD11.1(P)
N$556: P5.23 PAD12.1(P)
N$557: P5.24 PAD13.1(P)
N$558: P5.25 PAD14.1(P)
N$559: P5.26 PAD15.1(P)
N$560: P5.27 PAD16.1(P)
N$561: P5.28 PAD17.1(P)
N$562: P5.29 PAD18.1(P)
N$563: P5.30 PAD19.1(P)
N$564: P5.31 PAD20.1(P)
N$565: P5.32 PAD21.1(P)
N$566: P5.33 PAD22.1(P)
N$567: P5.34 PAD23.1(P)
N$568: P5.35 PAD24.1(P)
N$569: P5.36 PAD25.1(P)
N$570: P5.37 PAD26.1(P)
N$571: P5.38 PAD27.1(P)
N$572: P5.39 PAD28.1(P)
N$573: P5.40 PAD29.1(P)
SR0: P5.1 X132.1(P)
SR1: P5.2 X133.1(P)
SR2: P5.3 X134.1(P)
SR3: P5.4 X135.1(P)
SR4: P5.5 X136.1(P)
SR5: P5.6 X137.1(P)
SR6: P5.7 X138.1(P)
SR7: P5.8 X139.1(P)
SR8: P5.10 X141.1(P)
SR9: P5.11 X142.1(P)
SR10: P5.12 X143.1(P)
SR11: P5.13 X144.1(P)
SR12: P5.14 X145.1(P)
SR13: P5.15 X146.1(P)
SR14: P5.16 X147.1(P)
SR15: P5.17 X148.1(P)
SRCOM [Power]: P5.9 P5.18 X140.1(P) X149.1(P)

### Notes on the sheet
- Informational & Override Switches (!FPLOCK! lock-out)
- Switch Register Low | Power Key Switch
- Position 1: 2-1, 5-4 (off)
- Position 2: 2-3, 5-4 (on, panel lock)
- Position 3: 2-3, 5-6 (on, panel unlock)
- ATX Power Supply Unit assumed. | Start
- Reset
- Up: Verbose (all LEDs on).
- Run
- Down: Quiet (many LEDS off)
- Stop
- MFD: show Output
- MFD: show DR
- IFR6
- MFD: show uADDR | IFR1
- Debugging Switches (!SAFE! lock-out)
- RAM Bank
- Load Address
- ROM Bank
- Switch Register High
- Load IR
- Fast (10)
- Load AC
- Slow 1 (11)
- Deposit Memory | Slow 2 (01)
- Deposit Memory & Increment
- Microstep
- Step Instruction
- Examine Memory
- Examine Memory & Increment
- Write I/O
- Write I/O & Increment
- TODO:
- * DRC
- Read I/O
- Read I/O & Increment
- U

## Library data of the parts
JP1-JP9 = jumper:JP2E: JUMPER
P1-P6 = con-3m:2540-: 3M (TM) Pak 100 4-Wall Header Source: 3M; OC_FARNELL: unknown; OC_NEWARK: unknown
PAD1-PAD29 = wirepad:1,6/0,8: THROUGH-HOLE PAD
R1-R122 = rcl:R-EU_: RESISTOR, European symbol
U$1 U$2 U$5-U$8 U$12 U$14 = alexios:HOLE: Hole for a standoff or mount. Hole diameter: 3.3mm. External Diameter: 6mm.
X1-X16 X18-X25 X27-X42 X44-X52 X54-X69 X71-X75 X77-X92 X94-X101 X103-X130 X132-X139 X141-X148 X150-X162 X164-X171 X173-X189 = wirepad:1,6/0,9: THROUGH-HOLE PAD
X17 X26 X43 X53 X70 X76 X93 X102 X131 X140 X149 X163 X172 = wirepad:2,54/1,0: THROUGH-HOLE PAD

## Net classes
0 default: width 0.305 mm, clearance 0.254 mm
1 Power: width 0.635 mm, clearance 0.254 mm
2 12V: width 0.635 mm, clearance 0.635 mm

## Board
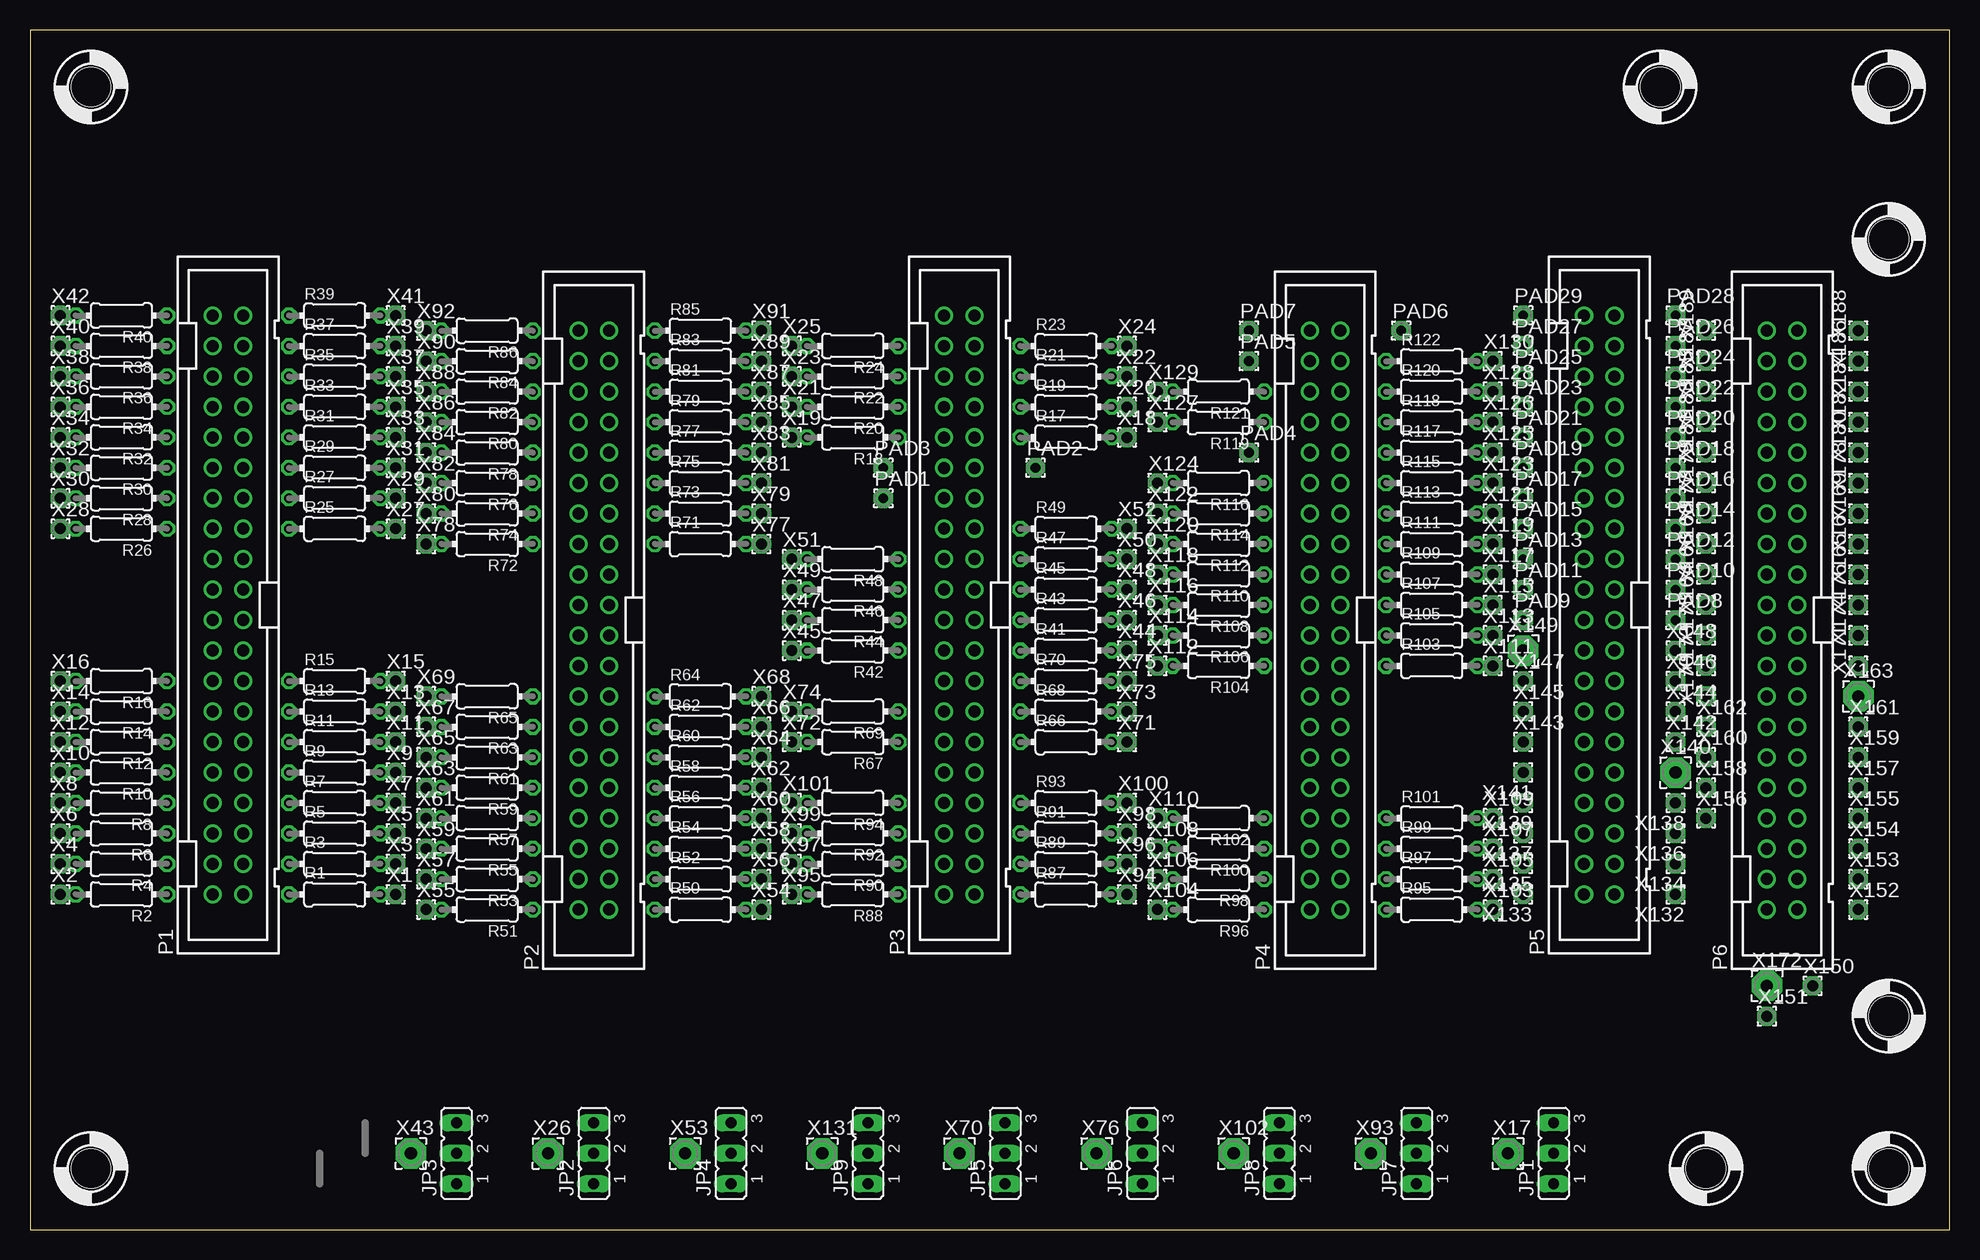
[diagram p2: board, top side]
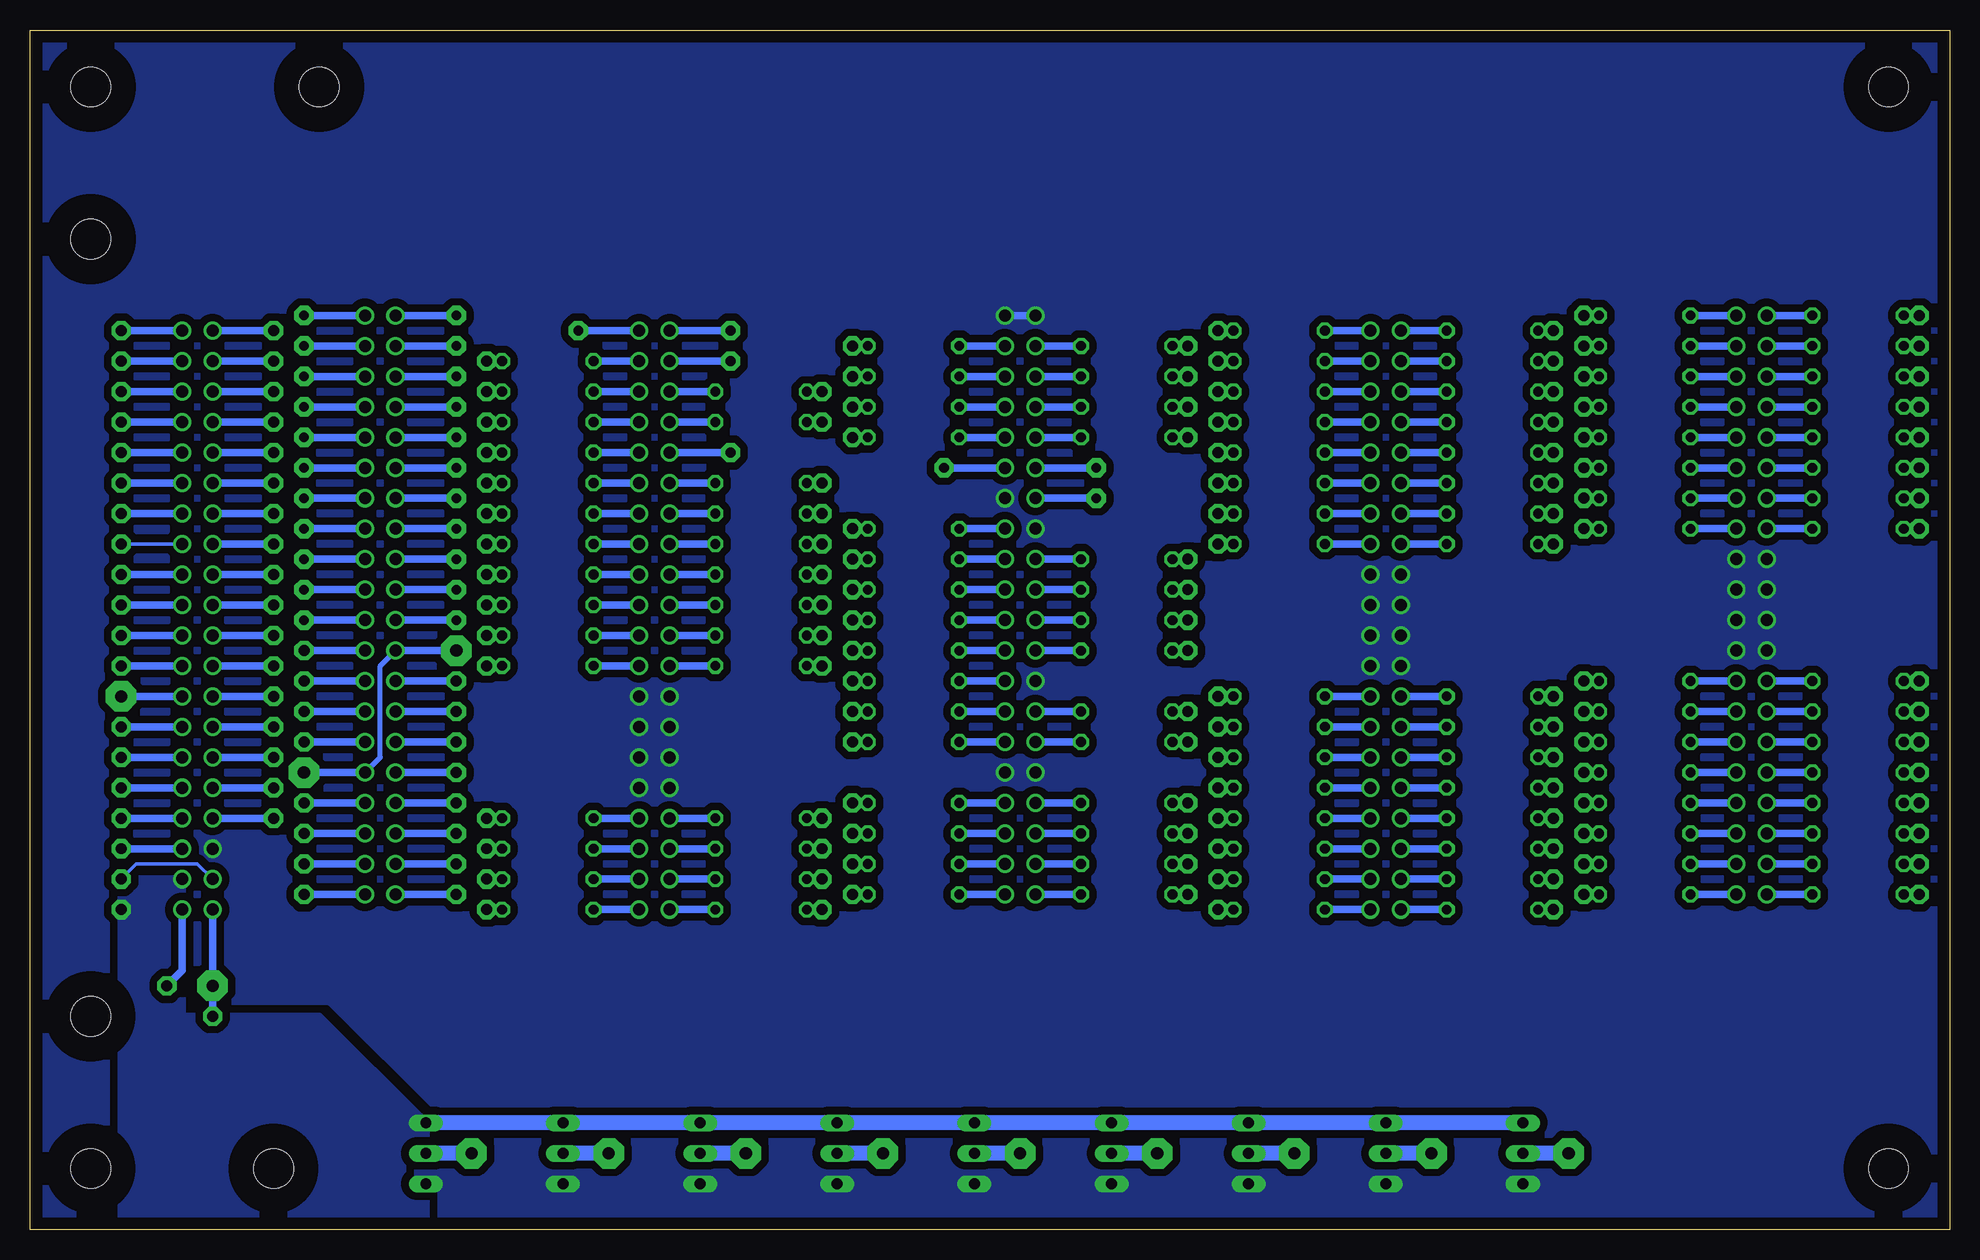
[diagram p3: board, bottom side, seen from below]

Size 160 x 100 mm. Coordinates in mm from the lower left corner, seen from the top.
Outline: 0,0 160,0 160,100 0,100 0,0
Copper layers (1*16): Top 0.035mm / dielectric 1.5mm / Bottom 0.035mm
Design rules "default": minimum track width 10mil, minimum drill 24mil, track to track 8mil, track to pad 8mil, pad to pad 8mil, via to via 8mil, smd to smd 8mil, copper to edge 40mil, drill to drill 8mil, minimum pad ring 10mil, minimum via ring 8mil, stop-mask expansion 4mil, vias tented up to drill 0mil, thermal gap 10mil

### Footprints (pad centres in the part's own frame; a part is rotated, then mirrored left to right if it is on the bottom)
JP2 = drill 0.914 long: 1 -2.54,0; 2 0,0; 3 2.54,0
PAK100/2500-40 = drill 1 pad 1.422 round: 1 -24.13,-1.27; 2 -24.13,1.27; 3 -21.59,-1.27; 4 -21.59,1.27; 5 -19.05,-1.27; 6 -19.05,1.27; 7 -16.51,-1.27; 8 -16.51,1.27; 9 -13.97,-1.27; 10 -13.97,1.27; 11 -11.43,-1.27; 12 -11.43,1.27; 13 -8.89,-1.27; 14 -8.89,1.27; 15 -6.35,-1.27; 16 -6.35,1.27; 17 -3.81,-1.27; 18 -3.81,1.27; 19 -1.27,-1.27; 20 -1.27,1.27; 21 1.27,-1.27; 22 1.27,1.27; 23 3.81,-1.27; 24 3.81,1.27; 25 6.35,-1.27; 26 6.35,1.27; 27 8.89,-1.27; 28 8.89,1.27; 29 11.43,-1.27; 30 11.43,1.27; 31 13.97,-1.27; 32 13.97,1.27; 33 16.51,-1.27; 34 16.51,1.27; 35 19.05,-1.27; 36 19.05,1.27; 37 21.59,-1.27; 38 21.59,1.27; 39 24.13,-1.27; 40 24.13,1.27
1,6/0,8 = drill 0.813 pad 1.6 octagon: 1 0,0
0204/7 = drill 0.813 octagon: 1 -3.81,0; 2 3.81,0
STANDOFF_28_60 = hole 3.302: 0,0
1,6/0,9 = drill 0.914 pad 1.6 octagon: 1 0,0
2,54/1,0 = drill 1.016 pad 2.54 octagon: 1 0,0

### Placement (x,y rotation side)
JP1  127,6.35 90 top
JP2  46.99,6.35 90 top
JP3  35.56,6.35 90 top
JP4  58.42,6.35 90 top
JP5  81.28,6.35 90 top
JP6  92.71,6.35 90 top
JP7  115.57,6.35 90 top
JP8  104.14,6.35 90 top
JP9  69.85,6.35 90 top
P1  16.51,52.07 90 top
P2  46.99,50.8 90 top
P3  77.47,52.07 90 top
P4  107.95,50.8 90 top
P5  130.81,52.07 90 top
P6  146.05,50.8 90 top
PAD1  71.12,60.96 0 top
PAD2  83.82,63.5 0 top
PAD3  71.12,63.5 0 top
PAD4  101.6,64.77 0 top
PAD5  101.6,72.39 0 top
PAD6  114.3,74.93 0 top
PAD7  101.6,74.93 0 top
PAD8  137.16,50.8 0 top
PAD9  124.46,50.8 0 top
PAD10  137.16,53.34 0 top
PAD11  124.46,53.34 0 top
PAD12  137.16,55.88 0 top
PAD13  124.46,55.88 0 top
PAD14  137.16,58.42 0 top
PAD15  124.46,58.42 0 top
PAD16  137.16,60.96 0 top
PAD17  124.46,60.96 0 top
PAD18  137.16,63.5 0 top
PAD19  124.46,63.5 0 top
PAD20  137.16,66.04 0 top
PAD21  124.46,66.04 0 top
PAD22  137.16,68.58 0 top
PAD23  124.46,68.58 0 top
PAD24  137.16,71.12 0 top
PAD25  124.46,71.12 0 top
PAD26  137.16,73.66 0 top
PAD27  124.46,73.66 0 top
PAD28  137.16,76.2 0 top
PAD29  124.46,76.2 0 top
R1  25.4,27.94 0 top
R2  7.62,27.94 180 top
R3  25.4,30.48 0 top
R4  7.62,30.48 180 top
R5  25.4,33.02 0 top
R6  7.62,33.02 180 top
R7  25.4,35.56 0 top
R8  7.62,35.56 180 top
R9  25.4,38.1 0 top
R10  7.62,38.1 180 top
R11  25.4,40.64 0 top
R12  7.62,40.64 180 top
R13  25.4,43.18 0 top
R14  7.62,43.18 180 top
R15  25.4,45.72 0 top
R16  7.62,45.72 180 top
R17  86.36,66.04 0 top
R18  68.58,66.04 180 top
R19  86.36,68.58 0 top
R20  68.58,68.58 180 top
R21  86.36,71.12 0 top
R22  68.58,71.12 180 top
R23  86.36,73.66 0 top
R24  68.58,73.66 180 top
R25  25.4,58.42 0 top
R26  7.62,58.42 180 top
R27  25.4,60.96 0 top
R28  7.62,60.96 180 top
R29  25.4,63.5 0 top
R30  7.62,63.5 180 top
R31  25.4,66.04 0 top
R32  7.62,66.04 180 top
R33  25.4,68.58 0 top
R34  7.62,68.58 180 top
R35  25.4,71.12 0 top
R36  7.62,71.12 180 top
R37  25.4,73.66 0 top
R38  7.62,73.66 180 top
R39  25.4,76.2 0 top
R40  7.62,76.2 180 top
R41  86.36,48.26 0 top
R42  68.58,48.26 180 top
R43  86.36,50.8 0 top
R44  68.58,50.8 180 top
R45  86.36,53.34 0 top
R46  68.58,53.34 180 top
R47  86.36,55.88 0 top
R48  68.58,55.88 180 top
R49  86.36,58.42 0 top
R50  55.88,26.67 0 top
R51  38.1,26.67 180 top
R52  55.88,29.21 0 top
R53  38.1,29.21 180 top
R54  55.88,31.75 0 top
R55  38.1,31.75 180 top
R56  55.88,34.29 0 top
R57  38.1,34.29 180 top
R58  55.88,36.83 0 top
R59  38.1,36.83 180 top
R60  55.88,39.37 0 top
R61  38.1,39.37 180 top
R62  55.88,41.91 0 top
R63  38.1,41.91 180 top
R64  55.88,44.45 0 top
R65  38.1,44.45 180 top
R66  86.36,40.64 0 top
R67  68.58,40.64 180 top
R68  86.36,43.18 0 top
R69  68.58,43.18 180 top
R70  86.36,45.72 0 top
R71  55.88,57.15 0 top
R72  38.1,57.15 180 top
R73  55.88,59.69 0 top
R74  38.1,59.69 180 top
R75  55.88,62.23 0 top
R76  38.1,62.23 180 top
R77  55.88,64.77 0 top
R78  38.1,64.77 180 top
R79  55.88,67.31 0 top
R80  38.1,67.31 180 top
R81  55.88,69.85 0 top
R82  38.1,69.85 180 top
R83  55.88,72.39 0 top
R84  38.1,72.39 180 top
R85  55.88,74.93 0 top
R86  38.1,74.93 180 top
R87  86.36,27.94 0 top
R88  68.58,27.94 180 top
R89  86.36,30.48 0 top
R90  68.58,30.48 180 top
R91  86.36,33.02 0 top
R92  68.58,33.02 180 top
R93  86.36,35.56 0 top
R94  68.58,35.56 180 top
R95  116.84,26.67 0 top
R96  99.06,26.67 180 top
R97  116.84,29.21 0 top
R98  99.06,29.21 180 top
R99  116.84,31.75 0 top
R100  99.06,31.75 180 top
R101  116.84,34.29 0 top
R102  99.06,34.29 180 top
R103  116.84,46.99 0 top
R104  99.06,46.99 180 top
R105  116.84,49.53 0 top
R106  99.06,49.53 180 top
R107  116.84,52.07 0 top
R108  99.06,52.07 180 top
R109  116.84,54.61 0 top
R110  99.06,54.61 180 top
R111  116.84,57.15 0 top
R112  99.06,57.15 180 top
R113  116.84,59.69 0 top
R114  99.06,59.69 180 top
R115  116.84,62.23 0 top
R116  99.06,62.23 180 top
R117  116.84,64.77 0 top
R118  116.84,67.31 0 top
R119  99.06,67.31 180 top
R120  116.84,69.85 0 top
R121  99.06,69.85 180 top
R122  116.84,72.39 0 top
U$1  154.94,95.25 0 top
U$2  154.94,82.55 0 top
U$5  5.08,95.25 0 top
U$6  5.08,5.08 0 top
U$7  139.7,5.08 0 top
U$8  135.89,95.25 0 top
U$12  154.94,5.08 90 top
U$14  154.94,17.78 90 top
X1  30.48,27.94 0 top
X2  2.54,27.94 0 top
X3  30.48,30.48 0 top
X4  2.54,30.48 0 top
X5  30.48,33.02 0 top
X6  2.54,33.02 0 top
X7  30.48,35.56 0 top
X8  2.54,35.56 0 top
X9  30.48,38.1 0 top
X10  2.54,38.1 0 top
X11  30.48,40.64 0 top
X12  2.54,40.64 0 top
X13  30.48,43.18 0 top
X14  2.54,43.18 0 top
X15  30.48,45.72 0 top
X16  2.54,45.72 0 top
X17  123.19,6.35 0 top
X18  91.44,66.04 0 top
X19  63.5,66.04 0 top
X20  91.44,68.58 0 top
X21  63.5,68.58 0 top
X22  91.44,71.12 0 top
X23  63.5,71.12 0 top
X24  91.44,73.66 0 top
X25  63.5,73.66 0 top
X26  43.18,6.35 0 top
X27  30.48,58.42 0 top
X28  2.54,58.42 0 top
X29  30.48,60.96 0 top
X30  2.54,60.96 0 top
X31  30.48,63.5 0 top
X32  2.54,63.5 0 top
X33  30.48,66.04 0 top
X34  2.54,66.04 0 top
X35  30.48,68.58 0 top
X36  2.54,68.58 0 top
X37  30.48,71.12 0 top
X38  2.54,71.12 0 top
X39  30.48,73.66 0 top
X40  2.54,73.66 0 top
X41  30.48,76.2 0 top
X42  2.54,76.2 0 top
X43  31.75,6.35 0 top
X44  91.44,48.26 0 top
X45  63.5,48.26 0 top
X46  91.44,50.8 0 top
X47  63.5,50.8 0 top
X48  91.44,53.34 0 top
X49  63.5,53.34 0 top
X50  91.44,55.88 0 top
X51  63.5,55.88 0 top
X52  91.44,58.42 0 top
X53  54.61,6.35 0 top
X54  60.96,26.67 0 top
X55  33.02,26.67 0 top
X56  60.96,29.21 0 top
X57  33.02,29.21 0 top
X58  60.96,31.75 0 top
X59  33.02,31.75 0 top
X60  60.96,34.29 0 top
X61  33.02,34.29 0 top
X62  60.96,36.83 0 top
X63  33.02,36.83 0 top
X64  60.96,39.37 0 top
X65  33.02,39.37 0 top
X66  60.96,41.91 0 top
X67  33.02,41.91 0 top
X68  60.96,44.45 0 top
X69  33.02,44.45 0 top
X70  77.47,6.35 0 top
X71  91.44,40.64 0 top
X72  63.5,40.64 0 top
X73  91.44,43.18 0 top
X74  63.5,43.18 0 top
X75  91.44,45.72 0 top
X76  88.9,6.35 0 top
X77  60.96,57.15 0 top
X78  33.02,57.15 0 top
X79  60.96,59.69 0 top
X80  33.02,59.69 0 top
X81  60.96,62.23 0 top
X82  33.02,62.23 0 top
X83  60.96,64.77 0 top
X84  33.02,64.77 0 top
X85  60.96,67.31 0 top
X86  33.02,67.31 0 top
X87  60.96,69.85 0 top
X88  33.02,69.85 0 top
X89  60.96,72.39 0 top
X90  33.02,72.39 0 top
X91  60.96,74.93 0 top
X92  33.02,74.93 0 top
X93  111.76,6.35 0 top
X94  91.44,27.94 0 top
X95  63.5,27.94 0 top
X96  91.44,30.48 0 top
X97  63.5,30.48 0 top
X98  91.44,33.02 0 top
X99  63.5,33.02 0 top
X100  91.44,35.56 0 top
X101  63.5,35.56 0 top
X102  100.33,6.35 0 top
X103  121.92,26.67 0 top
X104  93.98,26.67 0 top
X105  121.92,29.21 0 top
X106  93.98,29.21 0 top
X107  121.92,31.75 0 top
X108  93.98,31.75 0 top
X109  121.92,34.29 0 top
X110  93.98,34.29 0 top
X111  121.92,46.99 0 top
X112  93.98,46.99 0 top
X113  121.92,49.53 0 top
X114  93.98,49.53 0 top
X115  121.92,52.07 0 top
X116  93.98,52.07 0 top
X117  121.92,54.61 0 top
X118  93.98,54.61 0 top
X119  121.92,57.15 0 top
X120  93.98,57.15 0 top
X121  121.92,59.69 0 top
X122  93.98,59.69 0 top
X123  121.92,62.23 0 top
X124  93.98,62.23 0 top
X125  121.92,64.77 0 top
X126  121.92,67.31 0 top
X127  93.98,67.31 0 top
X128  121.92,69.85 0 top
X129  93.98,69.85 0 top
X130  121.92,72.39 0 top
X131  66.04,6.35 0 top
X132  137.16,27.94 180 top
X133  124.46,27.94 180 top
X134  137.16,30.48 180 top
X135  124.46,30.48 180 top
X136  137.16,33.02 180 top
X137  124.46,33.02 180 top
X138  137.16,35.56 180 top
X139  124.46,35.56 180 top
X140  137.16,38.1 0 top
X141  124.46,38.1 180 top
X142  137.16,40.64 0 top
X143  124.46,40.64 0 top
X144  137.16,43.18 0 top
X145  124.46,43.18 0 top
X146  137.16,45.72 0 top
X147  124.46,45.72 0 top
X148  137.16,48.26 0 top
X149  124.46,48.26 0 top
X150  148.59,20.32 0 top
X151  144.78,17.78 0 top
X152  152.4,26.67 0 top
X153  152.4,29.21 0 top
X154  152.4,31.75 0 top
X155  152.4,34.29 0 top
X156  139.7,34.29 0 top
X157  152.4,36.83 0 top
X158  139.7,36.83 0 top
X159  152.4,39.37 0 top
X160  139.7,39.37 0 top
X161  152.4,41.91 0 top
X162  139.7,41.91 0 top
X163  152.4,44.45 0 top
X164  139.7,52.07 90 top
X165  152.4,54.61 90 top
X166  139.7,54.61 90 top
X167  152.4,57.15 90 top
X168  139.7,57.15 90 top
X169  152.4,59.69 90 top
X170  139.7,44.45 90 top
X171  152.4,46.99 90 top
X172  144.78,20.32 0 top
X173  139.7,46.99 90 top
X174  152.4,49.53 90 top
X175  139.7,49.53 90 top
X176  152.4,52.07 90 top
X177  139.7,59.69 90 top
X178  152.4,62.23 90 top
X179  139.7,62.23 90 top
X180  152.4,64.77 90 top
X181  139.7,64.77 90 top
X182  152.4,67.31 90 top
X183  139.7,67.31 90 top
X184  152.4,69.85 90 top
X185  139.7,69.85 90 top
X186  152.4,72.39 90 top
X187  139.7,72.39 90 top
X188  152.4,74.93 90 top
X189  139.7,74.93 90 top

### Tracks (layer width: path | path; a pad name or v marks a point on that pad's centre or on a via)
!FPLOCK
  Bottom 0.61: P6.2 X172.1 X151.1
!SAFE
  Bottom 0.61: P6.15 X163.1
!SWFAST
  Bottom 0.305: P6.25 X167.1
!SWIFR1
  Bottom 0.61: X175.1 P6.20
!SWIFR6
  Bottom 0.61: P6.21 X176.1
!SWINC
  Bottom 0.61: P6.11 X159.1
!SWIOR
  Bottom 0.61: X162.1 P6.14
!SWIOW
  Bottom 0.61: P6.13 X161.1
!SWLDAC
  Bottom 0.61: X156.1 P6.8
!SWLDADDR
  Bottom 0.61: P6.7 X155.1
!SWLDIR
  Bottom 0.61: P6.9 X157.1
!SWLEDSON
  Bottom 1.27: JP3.3 JP2.3 JP4.3 JP9.3 JP5.3 JP6.3 JP8.3 JP7.3 JP1.3
  pour Bottom (isolate 0.61, rank 3, no thermals): 127,0 127,8.89 135.89,17.78 147.32,17.78 147.32,29.21 152.4,29.21 152.4,0
!SWMEMR
  Bottom 0.61: X160.1 P6.12
!SWMEMW
  Bottom 0.61: X158.1 P6.10
!SWMFD0
  Bottom 0.305: P6.4 146.05,30.48 151.13,30.48 X153.1
!SWMFD1
  Bottom 0.61: P6.5 X154.1
!SWPWRON
  Bottom 0.61: P6.1 147.32,21.59 X150.1
!SWRAM
  Bottom 0.61: P6.23 X165.1
!SWRESET
  Bottom 0.61: P6.17 X171.1
!SWROM
  Bottom 0.61: X164.1 P6.22
!SWRUN
  Bottom 0.61: P6.19 X174.1
!SWSLOW
  Bottom 0.61: X166.1 P6.24
!SWSTART
  Bottom 0.61: X170.1 P6.16
!SWSTEP
  Bottom 0.61: P6.27 X169.1
!SWSTOP
  Bottom 0.61: X173.1 P6.18
!SWUSTEP
  Bottom 0.61: X168.1 P6.26
AC0
  Bottom 0.61: P1.1 R1.1
AC1
  Bottom 0.61: R2.1 P1.2
AC2
  Bottom 0.61: P1.3 R3.1
AC3
  Bottom 0.61: R4.1 P1.4
AC4
  Bottom 0.61: P1.5 R5.1
AC5
  Bottom 0.61: R6.1 P1.6
AC6
  Bottom 0.61: P1.7 R7.1
AC7
  Bottom 0.61: R8.1 P1.8
AC8
  Bottom 0.61: P1.9 R9.1
AC9
  Bottom 0.61: R10.1 P1.10
AC10
  Bottom 0.61: P1.11 R11.1
AC11
  Bottom 0.61: R12.1 P1.12
AC12
  Bottom 0.61: P1.13 R13.1
AC13
  Bottom 0.61: R14.1 P1.14
AC14
  Bottom 0.61: P1.15 R15.1
AC15
  Bottom 0.61: R16.1 P1.16
BANK0
  Bottom 0.61: R42.1 P3.18
BANK1
  Bottom 0.61: P3.19 R43.1
BANK2
  Bottom 0.61: R44.1 P3.20
BANK3
  Bottom 0.61: P3.21 R45.1
BANK4
  Bottom 0.61: R46.1 P3.22
BANK5
  Bottom 0.61: P3.23 R47.1
BANK6
  Bottom 0.61: R48.1 P3.24
BANK7
  Bottom 0.61: P3.25 R49.1
BANKING
  Bottom 0.61: P3.17 R41.1
BCLI
  Bottom 0.61: R110.1 P4.24
BCLL
  Bottom 0.61: R108.1 P4.22
BCPL
  Bottom 0.61: P4.21 R107.1
BEND
  Bottom 0.61: R114.1 P4.28
BFIRQ
  Bottom 0.61: R69.1 P3.14
BFL
  Bottom 0.61: P3.15 R70.1
BFNEG
  Bottom 0.61: P3.11 R66.1
BFV
  Bottom 0.61: P3.13 R68.1
BFZERO
  Bottom 0.61: R67.1 P3.12
BINCAC
  Bottom 0.61: P4.25 R111.1
BINCDR
  Bottom 0.61: R112.1 P4.26
BINCPC
  Bottom 0.61: R106.1 P4.20
BIO
  Bottom 0.61: R88.1 P3.2
BMEM
  Bottom 0.61: P3.1 R87.1
BOPIF0
  Bottom 0.61: R102.1 P4.8
BOPIF1
  Bottom 0.61: P4.17 R103.1
BOPIF2
  Bottom 0.61: R104.1 P4.18
BOPIF3
  Bottom 0.61: P4.19 R105.1
BR
  Bottom 0.61: P3.3 R89.1
BRUNIT0
  Bottom 0.61: P4.1 R95.1
BRUNIT1
  Bottom 0.61: R96.1 P4.2
BRUNIT2
  Bottom 0.61: P4.3 R97.1
BRUNIT3
  Bottom 0.61: R98.1 P4.4
BSTI
  Bottom 0.61: P4.23 R109.1
BUINSTR18
  Bottom 0.61: P4.27 R113.1
BW
  Bottom 0.61: R90.1 P3.4
BWUNIT0
  Bottom 0.61: P4.5 R99.1
BWUNIT1
  Bottom 0.61: R100.1 P4.6
BWUNIT2
  Bottom 0.61: P4.7 R101.1
FPEXEC
  Bottom 0.61: R121.1 P4.36
FPFETCH
  Bottom 0.61: P4.35 R120.1
FPINT
  Bottom 0.61: P4.37 R122.1
FPRUN
  Bottom 0.61: P4.33 R118.1
FPSTOP
  Bottom 0.61: R119.1 P4.34
GND
  Bottom 0.635: P3.40 P3.39
  pour Bottom (isolate 0.635, rank 6, no thermals): 0,100.33 160.02,100.33 160.02,0 0,0
IFR0
  Bottom 0.61: P3.31 R17.1
IFR1
  Bottom 0.61: R18.1 P3.32
IFR2
  Bottom 0.61: P3.33 R19.1
IFR3
  Bottom 0.61: R20.1 P3.34
IFR4
  Bottom 0.61: P3.35 R21.1
IFR5
  Bottom 0.61: R22.1 P3.36
IFR6
  Bottom 0.61: P3.37 R23.1
IFR7
  Bottom 0.61: R24.1 P3.38
IR0
  Bottom 0.61: P2.1 R50.1
IR1
  Bottom 0.61: R51.1 P2.2
IR2
  Bottom 0.61: P2.3 R52.1
IR3
  Bottom 0.61: R53.1 P2.4
IR4
  Bottom 0.61: P2.5 R54.1
IR5
  Bottom 0.61: R55.1 P2.6
IR6
  Bottom 0.61: P2.7 R56.1
IR7
  Bottom 0.61: R57.1 P2.8
IR8
  Bottom 0.61: P2.9 R58.1
IR9
  Bottom 0.61: R59.1 P2.10
IR10
  Bottom 0.61: P2.11 R60.1
IR11
  Bottom 0.61: R61.1 P2.12
IR12
  Bottom 0.61: P2.13 R62.1
IR13
  Bottom 0.61: R63.1 P2.14
IR14
  Bottom 0.61: P2.15 R64.1
IR15
  Bottom 0.61: R65.1 P2.16
MFD0
  Bottom 0.61: P2.25 R71.1
MFD1
  Bottom 0.61: R72.1 P2.26
MFD2
  Bottom 0.61: P2.27 R73.1
MFD3
  Bottom 0.61: R74.1 P2.28
MFD4
  Bottom 0.61: P2.29 R75.1
MFD5
  Bottom 0.61: R76.1 P2.30
MFD6
  Bottom 0.61: P2.31 R77.1
MFD7
  Bottom 0.61: R78.1 P2.32
MFD8
  Bottom 0.61: P2.33 R79.1
MFD9
  Bottom 0.61: R80.1 P2.34
MFD10
  Bottom 0.61: P2.35 R81.1
MFD11
  Bottom 0.61: R82.1 P2.36
MFD12
  Bottom 0.61: P2.37 R83.1
MFD13
  Bottom 0.61: R84.1 P2.38
MFD14
  Bottom 0.61: P2.39 R85.1
MFD15
  Bottom 0.61: R86.1 P2.40
MISC1
  Bottom 0.61: P4.29 R115.1
MISC2
  Bottom 0.61: R116.1 P4.30
MISC3
  Bottom 0.61: P4.31 R117.1
N$1
  Bottom 1.27: X70.1 JP5.2
N$2
  Bottom 1.27: X93.1 JP7.2
N$3
  Bottom 1.27: X26.1 JP2.2
N$4
  Bottom 1.27: X76.1 JP6.2
N$5
  Bottom 1.27: X102.1 JP8.2
N$6
  Bottom 0.305: X25.1 R24.2
N$7
  Bottom 0.305: R23.2 X24.1
N$8
  Bottom 0.61: X177.1 P6.28
N$9
  Bottom 0.61: P6.29 X178.1
N$10
  Bottom 0.61: X179.1 P6.30
N$11
  Bottom 0.61: P6.31 X180.1
N$12
  Bottom 0.61: X181.1 P6.32
N$13
  Bottom 0.61: P6.33 X182.1
N$14
  Bottom 0.61: X183.1 P6.34
N$15
  Bottom 0.61: P6.35 X184.1
N$16
  Bottom 0.61: X185.1 P6.36
N$17
  Bottom 0.61: P6.37 X186.1
N$18
  Bottom 0.61: X187.1 P6.38
N$19
  Bottom 0.61: P6.39 X188.1
N$20
  Bottom 0.61: X189.1 P6.40
N$323
  Bottom 1.27: X43.1 JP3.2
N$324
  Bottom 1.27: X17.1 JP1.2
N$325
  Bottom 0.305: X104.1 R96.2
N$326
  Bottom 0.305: X4.1 R4.2
N$327
  Bottom 0.305: X72.1 R67.2
N$328
  Bottom 0.305: R95.2 X103.1
N$330
  Bottom 0.305: R17.2 X18.1
N$412
  Bottom 0.305: R3.2 X3.1
N$413
  Bottom 0.305: X2.1 R2.2
N$414
  Bottom 0.305: R1.2 X1.1
N$415
  Bottom 0.305: R7.2 X7.1
N$416
  Bottom 0.305: X6.1 R6.2
N$449
  Bottom 0.305: R5.2 X5.1
N$450
  Bottom 0.61: PAD1.1 P3.28
N$451
  Bottom 0.305: R89.2 X96.1
N$470
  Bottom 0.61: PAD5.1 P4.38
N$471
  Bottom 0.61: P4.39 PAD6.1
N$472
  Bottom 0.61: PAD7.1 P4.40
N$473
  Bottom 0.61: PAD4.1 P4.32
N$474
  Bottom 0.61: P3.29 PAD2.1
N$475
  Bottom 0.61: PAD3.1 P3.30
N$477
  Bottom 0.305: X10.1 R10.2
N$478
  Bottom 0.305: R9.2 X9.1
N$552
  Bottom 0.61: P5.19 PAD8.1
N$553
  Bottom 0.61: PAD9.1 P5.20
N$554
  Bottom 0.61: P5.21 PAD10.1
N$555
  Bottom 0.61: PAD11.1 P5.22
N$556
  Bottom 0.61: P5.23 PAD12.1
N$557
  Bottom 0.61: PAD13.1 P5.24
N$558
  Bottom 0.61: P5.25 PAD14.1
N$559
  Bottom 0.61: PAD15.1 P5.26
N$560
  Bottom 0.61: P5.27 PAD16.1
N$561
  Bottom 0.61: PAD17.1 P5.28
N$562
  Bottom 0.61: P5.29 PAD18.1
N$563
  Bottom 0.61: PAD19.1 P5.30
N$564
  Bottom 0.61: P5.31 PAD20.1
N$565
  Bottom 0.61: PAD21.1 P5.32
N$566
  Bottom 0.61: P5.33 PAD22.1
N$567
  Bottom 0.61: PAD23.1 P5.34
N$568
  Bottom 0.61: P5.35 PAD24.1
N$569
  Bottom 0.61: PAD25.1 P5.36
N$570
  Bottom 0.61: P5.37 PAD26.1
N$571
  Bottom 0.61: PAD27.1 P5.38
N$572
  Bottom 0.61: P5.39 PAD28.1
N$573
  Bottom 0.61: PAD29.1 P5.40
N$587
  Bottom 0.305: X8.1 R8.2
N$588
  Bottom 0.305: R13.2 X13.1
N$589
  Bottom 0.305: X12.1 R12.2
N$590
  Bottom 0.305: R11.2 X11.1
N$591
  Bottom 0.305: X16.1 R16.2
N$592
  Bottom 0.305: R15.2 X15.1
N$593
  Bottom 0.305: X14.1 R14.2
N$594
  Bottom 0.305: X30.1 R28.2
N$595
  Bottom 0.305: R27.2 X29.1
N$596
  Bottom 0.305: X28.1 R26.2
N$597
  Bottom 0.305: R25.2 X27.1
N$598
  Bottom 0.305: R31.2 X33.1
N$599
  Bottom 0.305: X32.1 R30.2
N$600
  Bottom 0.305: R29.2 X31.1
N$601
  Bottom 0.305: X36.1 R34.2
N$602
  Bottom 0.305: R33.2 X35.1
N$603
  Bottom 0.305: X34.1 R32.2
N$604
  Bottom 0.305: R37.2 X39.1
N$605
  Bottom 0.305: X38.1 R36.2
N$606
  Bottom 0.305: R35.2 X37.1
N$607
  Bottom 0.305: X42.1 R40.2
N$608
  Bottom 0.305: R39.2 X41.1
N$609
  Bottom 0.305: X40.1 R38.2
N$611
  Bottom 0.305: X57.1 R53.2
N$612
  Bottom 0.305: R52.2 X56.1
N$613
  Bottom 0.305: X55.1 R51.2
N$614
  Bottom 0.305: R50.2 X54.1
N$615
  Bottom 0.305: R56.2 X60.1
N$616
  Bottom 0.305: X59.1 R55.2
N$617
  Bottom 0.305: R54.2 X58.1
N$618
  Bottom 0.305: X63.1 R59.2
N$619
  Bottom 0.305: R58.2 X62.1
N$620
  Bottom 0.305: X61.1 R57.2
N$621
  Bottom 0.305: R62.2 X66.1
N$622
  Bottom 0.305: X65.1 R61.2
N$623
  Bottom 0.305: R60.2 X64.1
N$624
  Bottom 0.305: X69.1 R65.2
N$625
  Bottom 0.305: R64.2 X68.1
N$626
  Bottom 0.305: X67.1 R63.2
N$627
  Bottom 0.305: X80.1 R74.2
N$628
  Bottom 0.305: R73.2 X79.1
N$629
  Bottom 0.305: X78.1 R72.2
N$630
  Bottom 0.305: R77.2 X83.1
N$631
  Bottom 0.305: X82.1 R76.2
N$632
  Bottom 0.305: R75.2 X81.1
N$633
  Bottom 0.305: X86.1 R80.2
N$634
  Bottom 0.305: R79.2 X85.1
N$635
  Bottom 0.305: X84.1 R78.2
N$636
  Bottom 0.305: R83.2 X89.1
N$637
  Bottom 0.305: X88.1 R82.2
N$638
  Bottom 0.305: R81.2 X87.1
N$639
  Bottom 0.305: X92.1 R86.2
N$640
  Bottom 0.305: R85.2 X91.1
N$641
  Bottom 0.305: X90.1 R84.2
N$642
  Bottom 0.305: R71.2 X77.1
N$643
  Bottom 0.305: X19.1 R18.2
N$644
  Bottom 0.305: R19.2 X20.1
N$645
  Bottom 0.305: X21.1 R20.2
N$646
  Bottom 0.305: R21.2 X22.1
N$647
  Bottom 0.305: X23.1 R22.2
N$658
  Bottom 1.27: X131.1 JP9.2
N$659
  Bottom 0.305: R41.2 X44.1
N$660
  Bottom 0.305: X45.1 R42.2
N$661
  Bottom 0.305: R43.2 X46.1
N$662
  Bottom 0.305: X47.1 R44.2
N$663
  Bottom 0.305: R45.2 X48.1
N$664
  Bottom 0.305: X49.1 R46.2
N$665
  Bottom 0.305: R47.2 X50.1
N$666
  Bottom 0.305: X51.1 R48.2
N$667
  Bottom 0.305: R49.2 X52.1
N$668
  Bottom 1.27: X53.1 JP4.2
N$669
  Bottom 0.305: R66.2 X71.1
N$670
  Bottom 0.305: R68.2 X73.1
N$671
  Bottom 0.61: X74.1 R69.2
N$672
  Bottom 0.305: R70.2 X75.1
N$676
  Bottom 0.305: R87.2 X94.1
N$677
  Bottom 0.305: X95.1 R88.2
N$796
  Bottom 0.305: X97.1 R90.2
N$797
  Bottom 0.305: R91.2 X98.1
N$798
  Bottom 0.305: X99.1 R92.2
N$799
  Bottom 0.305: R93.2 X100.1
N$800
  Bottom 0.305: X101.1 R94.2
N$802
  Bottom 0.305: R97.2 X105.1
N$803
  Bottom 0.305: X106.1 R98.2
N$804
  Bottom 0.305: R99.2 X107.1
N$805
  Bottom 0.305: X108.1 R100.2
N$806
  Bottom 0.305: R101.2 X109.1
N$807
  Bottom 0.305: X110.1 R102.2
N$808
  Bottom 0.305: X112.1 R104.2
N$809
  Bottom 0.305: R103.2 X111.1
N$810
  Bottom 0.305: R105.2 X113.1
N$811
  Bottom 0.305: X114.1 R106.2
N$812
  Bottom 0.305: R107.2 X115.1
N$813
  Bottom 0.305: X116.1 R108.2
N$814
  Bottom 0.305: R109.2 X117.1
N$815
  Bottom 0.305: X118.1 R110.2
N$816
  Bottom 0.305: X120.1 R112.2
N$817
  Bottom 0.305: R111.2 X119.1
N$818
  Bottom 0.305: R113.2 X121.1
N$819
  Bottom 0.305: X122.1 R114.2
N$820
  Bottom 0.305: R115.2 X123.1
N$821
  Bottom 0.305: X124.1 R116.2
N$822
  Bottom 0.305: R117.2 X125.1
N$823
  Bottom 0.305: R118.2 X126.1
N$824
  Bottom 0.305: R120.2 X128.1
N$825
  Bottom 0.305: R122.2 X130.1
N$826
  Bottom 0.305: X127.1 R119.2
N$827
  Bottom 0.305: X129.1 R121.2
PC0
  Bottom 0.61: P1.25 R25.1
PC1
  Bottom 0.61: R26.1 P1.26
PC2
  Bottom 0.61: P1.27 R27.1
PC3
  Bottom 0.61: R28.1 P1.28
PC4
  Bottom 0.61: P1.29 R29.1
PC5
  Bottom 0.61: R30.1 P1.30
PC6
  Bottom 0.61: P1.31 R31.1
PC7
  Bottom 0.61: R32.1 P1.32
PC8
  Bottom 0.61: P1.33 R33.1
PC9
  Bottom 0.61: R34.1 P1.34
PC10
  Bottom 0.61: P1.35 R35.1
PC11
  Bottom 0.61: R36.1 P1.36
PC12
  Bottom 0.61: P1.37 R37.1
PC13
  Bottom 0.61: R38.1 P1.38
PC14
  Bottom 0.61: P1.39 R39.1
PC15
  Bottom 0.61: R40.1 P1.40
SR0
  Bottom 0.61: P5.1 X132.1
SR1
  Bottom 0.61: X133.1 P5.2
SR2
  Bottom 0.61: P5.3 X134.1
SR3
  Bottom 0.61: X135.1 P5.4
SR4
  Bottom 0.61: P5.5 X136.1
SR5
  Bottom 0.61: X137.1 P5.6
SR6
  Bottom 0.61: P5.7 X138.1
SR7
  Bottom 0.61: X139.1 P5.8
SR8
  Bottom 0.61: X141.1 P5.10
SR9
  Bottom 0.61: P5.11 X142.1
SR10
  Bottom 0.61: X143.1 P5.12
SR11
  Bottom 0.61: P5.13 X144.1
SR12
  Bottom 0.61: X145.1 P5.14
SR13
  Bottom 0.61: P5.15 X146.1
SR14
  Bottom 0.61: X147.1 P5.16
SR15
  Bottom 0.61: P5.17 X148.1
SRCOM
  Bottom 0.406: P5.9 130.81,39.37 130.81,46.99 P5.18
  Bottom 0.61: P5.9 X140.1 | P5.18 X149.1
UCB0
  Bottom 0.61: P3.5 R91.1
UCB1
  Bottom 0.61: R92.1 P3.6
UCB2
  Bottom 0.61: P3.7 R93.1
UCB3
  Bottom 0.61: R94.1 P3.8

### Text on the board
tDocu: CFT Front Panel break-out Rev A | http://www.bedroomlan.org/cft | PC | MFD | INTC | Switch Reg | Ctrl Unit | 15 | 15 | MBU | 1 | 0 | 1 | 0 | 15 | AC | IR | Control switches | Flags | 1 | 0 | 1 | Mem & uCB | 0 | Off | On | Switched | AC | PC | IR | MFD | INTC | MBU | Flags | UCB | Ctrl Unit